# EasyEDA Pro project 智能车主板.eprj

# Schematic Schematic1
Create Date: 2023-10-10; Page Name: 原理图; Project Name: 智能车主板; Schematic Name: Schematic1; Update Date: 2023-10-11; Company: 王庆浩; Page Size: A3; Version: V1.0
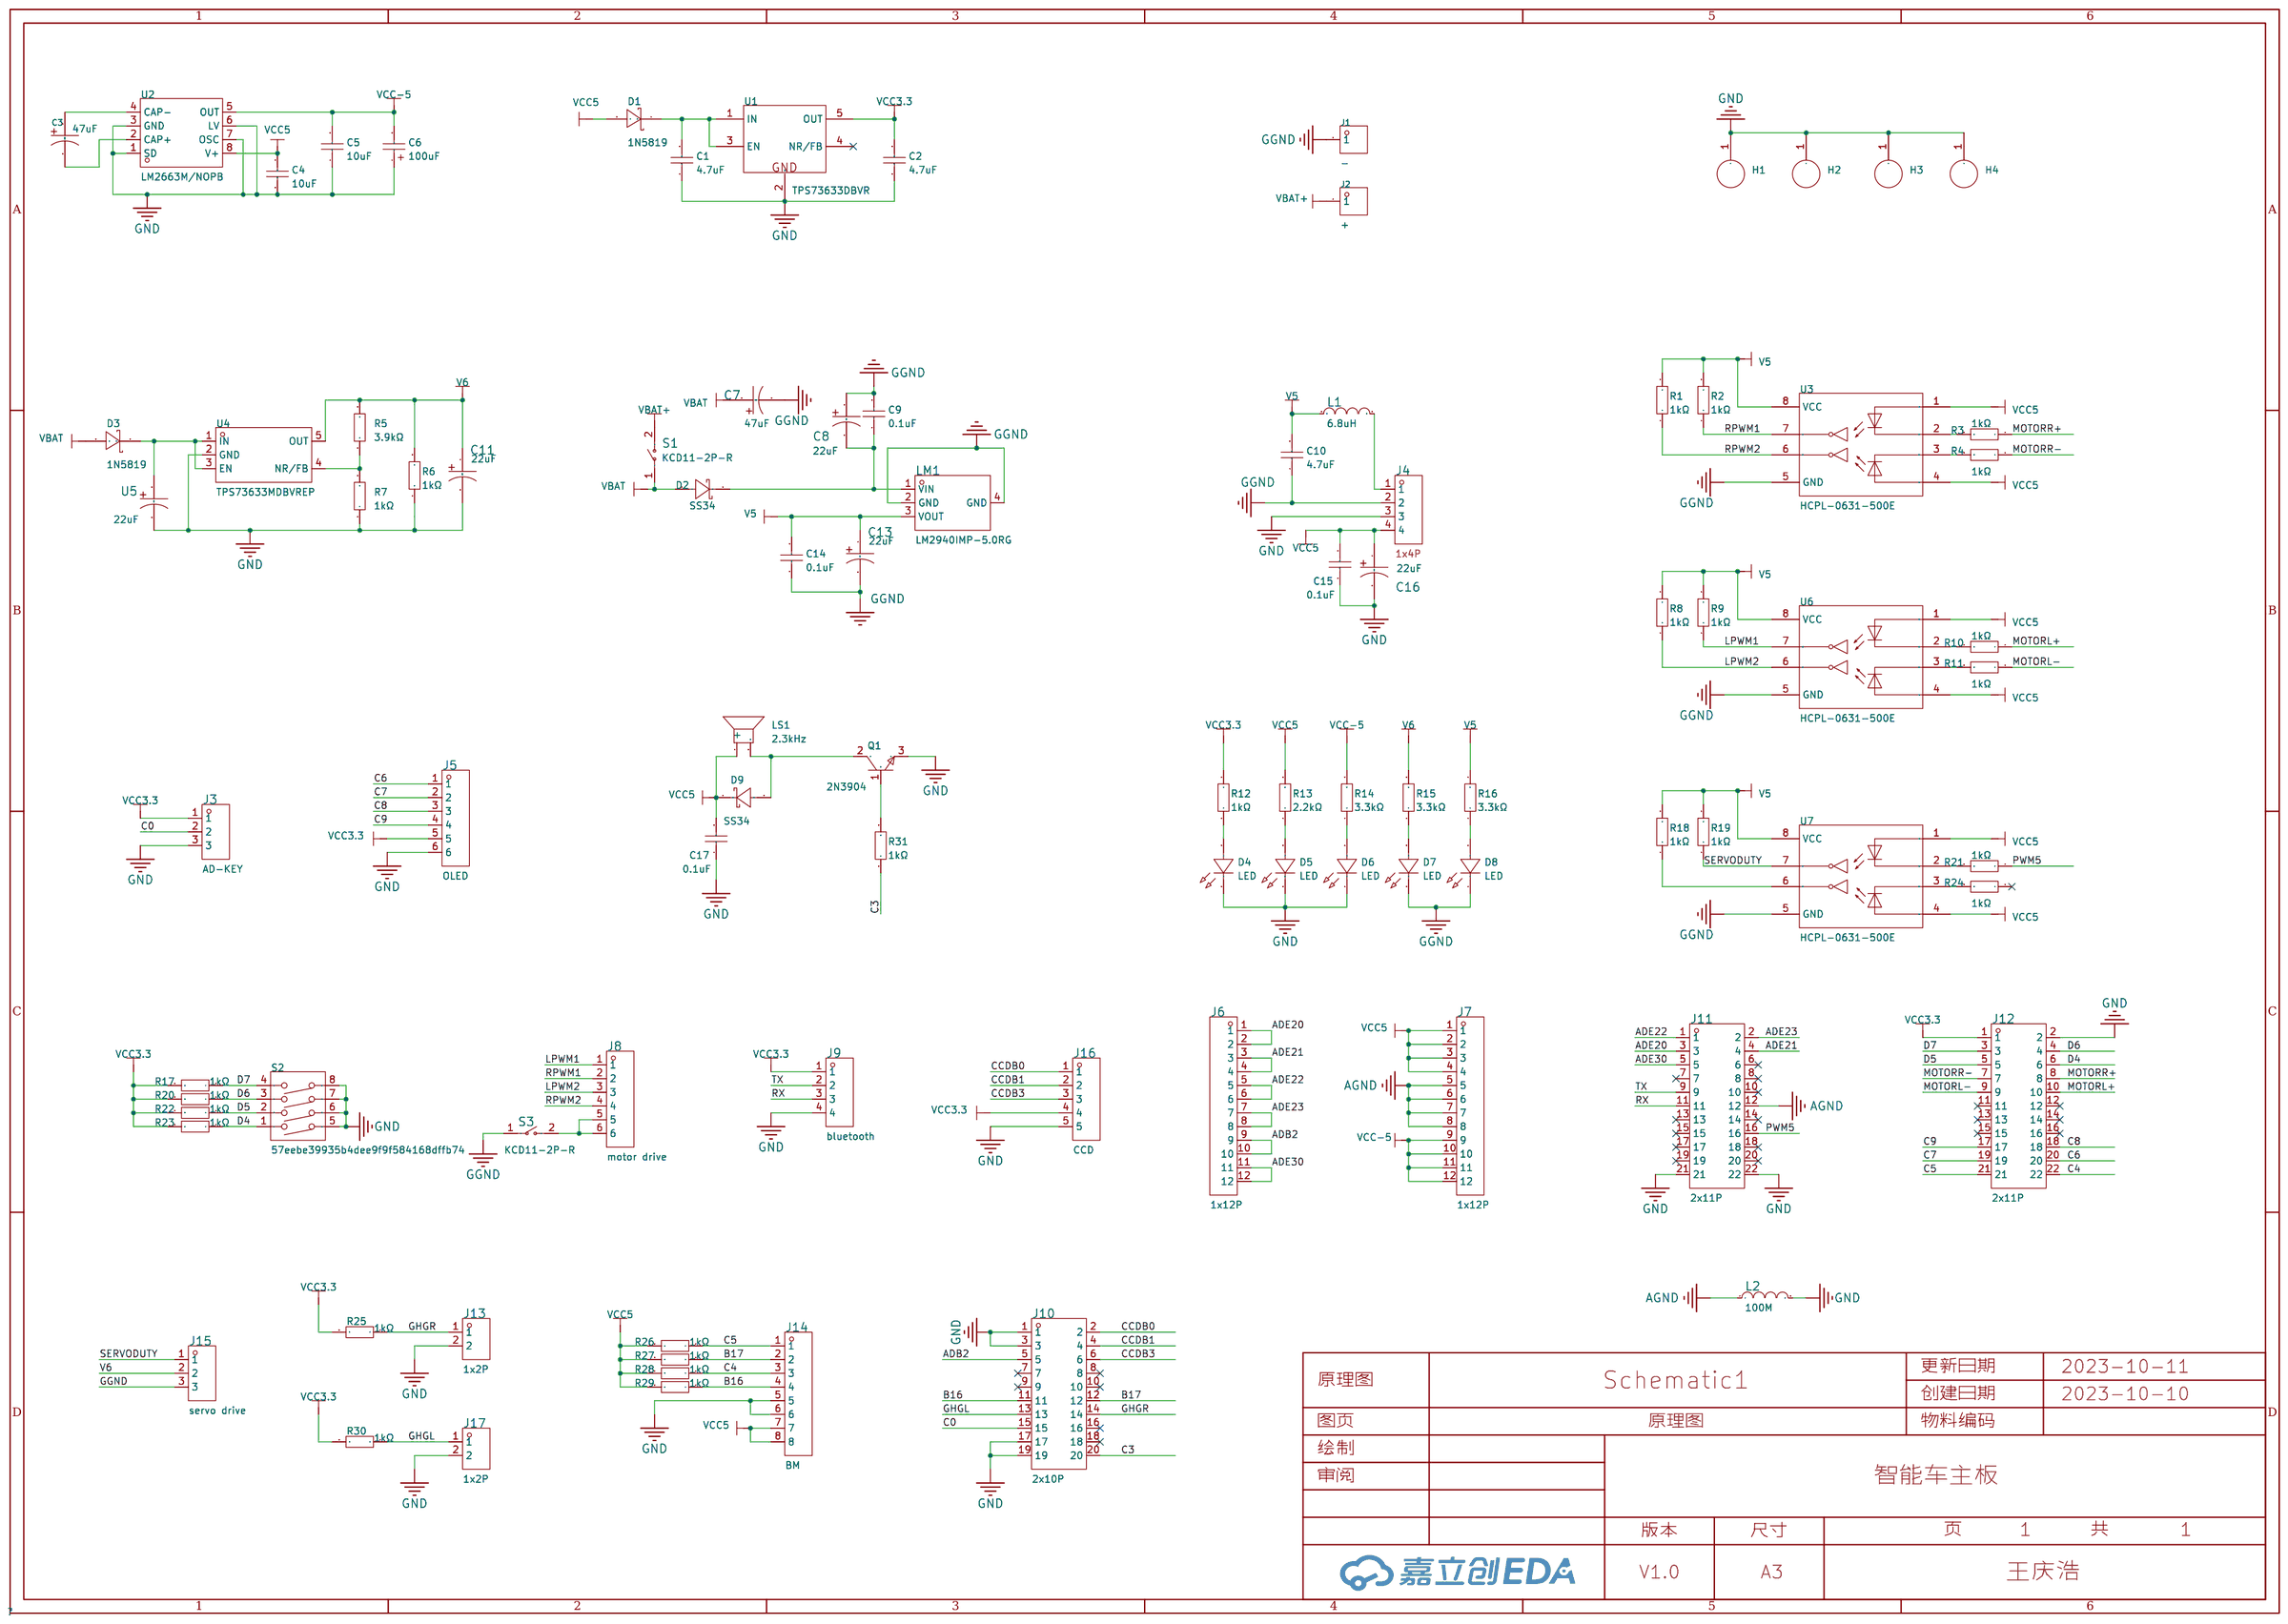
[diagram p0: schematic sheet]

## Parts
C1  4.7uF  [C0805]
C2  4.7uF  [C0805]
C3  47uF  [CAP-SMD_L6.0-W3.2-R-RD]
C4  10uF  [C0805]
C5  10uF  [C0805]
C6  100uF  [CAP-SMD_L3.2-W1.6-RD-C7171]
C7  47uF  [CAP-SMD_L7.3-W4.3-RD]
C8  22uF  [CAP-SMD_L6.0-W3.2-R-RD]
C9  0.1uF  [C0805]
C10  4.7uF  [C0805]
C11  22uF  [CAP-SMD_L7.3-W4.3-RD]
C13  22uF  [CAP-SMD_L7.3-W4.3-RD]
C14  0.1uF  [C0805]
C15  0.1uF  [C0805]
C16  22uF  [CAP-SMD_L7.3-W4.3-RD]
C17  0.1uF  [C0805]
D1  1N5819  [SMA_L4.4-W2.6-LS5.0-RD]
D2  SS34  [SMA_L4.3-W2.5-LS5.0-RD]
D3  1N5819  [SMA_L4.4-W2.6-LS5.0-RD]
D4  LED  [LED0805-RD_RED]
D5  LED  [LED0805-RD_RED]
D6  LED  [LED0805-RD_RED]
D7  LED  [LED0805-RD_RED]
D8  LED  [LED0805-RD_RED]
D9  SS34  [SMA_L4.3-W2.5-LS5.0-RD]
H1  -  [固定孔封装]
H2  -  [固定孔封装]
H3  -  [固定孔封装]
H4  -  [固定孔封装]
J1  -  [HDR-SMD_1P-P2.54-V-M_XKB_R1]
J2  +  [HDR-SMD_1P-P2.54-V-M_XKB_R1]
J3  AD-KEY  [HDR-TH_3P-P2.54-V-M]
J4  bf6de8a097bd4b3495073099155543ed  [HDR-TH_4P-P2.54-V-M]
J5  OLED  [HDR-TH_6P-P2.54-V-M]
J6  1x12P  [HDR-TH_12P-P2.54-V-M]
J7  1x12P  [HDR-TH_12P-P2.54-V-M]
J8  motor drive  [HDR-TH_6P-P2.54-V-M]
J9  bluetooth  [HDR-TH_4P-P2.54-V-M]
J10  2x10P  [HDR-TH_20P-P2.54-V-M-R2-C10-S2.54]
J11  2x11P  [HDR-TH_22P-P2.54-V-M-R2-C11-S2.54]
J12  2x11P  [HDR-TH_22P-P2.54-V-M-R2-C11-S2.54]
J13  1x2P  [HDR-TH_2P-P2.54-V-M]
J14  BM  [HDR-TH_8P-P2.54-V-M]
J15  servo drive  [HDR-TH_3P-P2.54-V-M]
J16  CCD  [HDR-TH_5P-P2.00-V-M]
J17  1x2P  [HDR-TH_2P-P2.54-V-M]
L1  6.8uH  [L0603]
L2  100M  [L0603]
LM1  LM2940IMP-5.0RG  [SOT-223-4_L6.5-W3.5-P2.30-LS7.0-BR]
LS1  2.3kHz  [BUZ-TH_BD12.0-P7.60-D0.6-FD]
Q1  2N3904  [TO-92-3_L4.6-W3.6-P1.30-L_2N3904]
R1  1kΩ  [R0805]
R2  1kΩ  [R0805]
R3  1kΩ  [R0805]
R4  1kΩ  [R0805]
R5  3.9kΩ  [R0805]
R6  1kΩ  [R0805]
R7  1kΩ  [R0805]
R8  1kΩ  [R0805]
R9  1kΩ  [R0805]
R10  1kΩ  [R0805]
R11  1kΩ  [R0805]
R12  1kΩ  [R0805]
R13  2.2kΩ  [R0805]
R14  3.3kΩ  [R0805]
R15  3.3kΩ  [R0805]
R16  3.3kΩ  [R0805]
R17  1kΩ  [R0805]
R18  1kΩ  [R0805]
R19  1kΩ  [R0805]
R20  1kΩ  [R0805]
R21  1kΩ  [R0805]
R22  1kΩ  [R0805]
R23  1kΩ  [R0805]
R24  1kΩ  [R0805]
R25  1kΩ  [R0805]
R26  1kΩ  [R0805]
R27  1kΩ  [R0805]
R28  1kΩ  [R0805]
R29  1kΩ  [R0805]
R30  1kΩ  [R0805]
R31  1kΩ  [R0805]
S1  KCD11-2P-R  [SW-TH_2P-L15.0-W10.5-P5.00_KCD11-2P-R]
S2  57eebe39935b4dee9f9f584168dffb74  [SW-TH_DSWB04LHGET]
S3  KCD11-2P-R  [SW-TH_2P-L15.0-W10.5-P5.00_KCD11-2P-R]
U1  TPS73633DBVR  [SOT-23-5_L3.0-W1.7-P0.95-LS2.8-BR]
U2  LM2663M/NOPB  [SOIC-8_L4.9-W3.9-P1.27-LS6.0-BL]
U3  HCPL-0631-500E  [SOIC-8_L4.9-W3.9-P1.27-LS6.0-BL]
U4  TPS73633MDBVREP  [SOT-23-5_L2.9-W1.6-P0.95-LS2.8-BR]
U5  22uF  [CAP-SMD_L7.3-W4.3-RD]
U6  HCPL-0631-500E  [SOIC-8_L4.9-W3.9-P1.27-LS6.0-BL]
U7  HCPL-0631-500E  [SOIC-8_L4.9-W3.9-P1.27-LS6.0-BL]

## Library data of the parts
C1 C2 C4 C5 = CL21A106KAYNNNE_C15850: 容值:10uF;精度:±10%;额定电压:25V;材质(温度系数):X5R;; LCSC Part Name: 10uF ±10% 25V; Supplier Part: C15850; Manufacturer: SAMSUNG(三星); Manufacturer Part: CL21A106KAYNNNE; Supplier Footprint: 0805; JLCPCB Part Class: 基础库; Datasheet: https://atta.szlcsc.com/upload/public/pdf/source/20160103/1457707679302.pdf; Supplier: LCSC; Tolerance: ±10%; Voltage Rated: 25V; Temperature Coefficient: X5R
C3 C8 = 293D476X0016C2TE3: 容值:47uF;精度:±20%;额定电压:16V;等效串联电阻:1Ω;; LCSC Part Name: 47uF ±20% 16V; Supplier Part: C3008964; Manufacturer: VISHAY(威世); Supplier Footprint: CASE-C-6032-28(mm); JLCPCB Part Class: Extended Part; Datasheet: https://atta.szlcsc.com/upload/public/pdf/source/20220525/65753A40397FD1DF7C7325870DC95DD0.pdf; Supplier: LCSC; Tolerance: ±20%; Rated Voltage: 16V; Equivalent Series Resistance(ESR): 1Ω; Operating Temperature: -55℃~+125℃
C6 = TAJA106K016RNJ: 容值:10uF;精度:±10%;额定电压:16V;等效串联电阻:3Ω@100kHz;; LCSC Part Name: 10uF ±10% 16V; Supplier Part: C7171; Manufacturer: Kyocera AVX; Supplier Footprint: CASE-A-3216; JLCPCB Part Class: 基础库; Datasheet: https://atta.szlcsc.com/upload/public/pdf/source/20160107/1457707748093.pdf; Supplier: LCSC; Tolerance: ±10%; Rated Voltage: 16V; Equivalent Series Resistance(ESR): 3Ω@100kHz; Operating Temperature: -55℃~+125℃
C7 C11 C13 C16 U5 = 293D475X9035D2TE3: LCSC Part Name: 钽电容; Supplier Part: C2980145; Manufacturer: VISHAY(威世); Supplier Footprint: CASE-D-7343-31(mm); JLCPCB Part Class: Extended Part; Datasheet: https://atta.szlcsc.com/upload/public/pdf/source/20230201/36862275542DDD9C7A81351881AA3AA9.pdf; Supplier: LCSC
C9 C10 C14 C15 C17 = CC0805KRX7R9BB104: 容值:100nF;精度:±10%;额定电压:50V;材质(温度系数):X7R;; LCSC Part Name: 100nF ±10% 50V; Supplier Part: C49678; Manufacturer: YAGEO(国巨); Supplier Footprint: 0805; JLCPCB Part Class: 基础库; Datasheet: https://atta.szlcsc.com/upload/public/pdf/source/20151026/1457707504898.pdf; Supplier: LCSC; Tolerance: ±10%; Voltage Rated: 50V; Temperature Coefficient: X7R
D1 D3 = 1N5819_C437199: 直流反向耐压(Vr):40V;平均整流电流(Io):1A;正向压降(Vf):500mV@1A;; LCSC Part Name: 40V 1A 500mV@1A; Supplier Part: C437199; Manufacturer: KEXIN(科信); Supplier Footprint: SMA; JLCPCB Part Class: Extended Part; Datasheet: https://atta.szlcsc.com/upload/public/pdf/source/20191012/C437199_83583E622A6684E767605E43C169C596.pdf; Supplier: LCSC; Reverse Voltage (Vr): 40V; Average Rectified Current (Io): 1A; Forward Voltage (Vf@If): 500mV@1A
D2 D9 = SS34_C727060: 二极管配置:独立式;直流反向耐压(Vr):40V;平均整流电流(Io):3A;正向压降(Vf):550mV@3A;; LCSC Part Name: 40V 3A 550mV@3A; Supplier Part: C727060; Manufacturer: TWGMC(台湾迪嘉); Supplier Footprint: SMA; JLCPCB Part Class: Extended Part; Datasheet: https://atta.szlcsc.com/upload/public/pdf/source/20200828/C727059_6599B6CAC5F3238B9C33E46794659DBE.pdf; Supplier: LCSC; Diode Configuration: 独立式; Reverse Voltage (Vr): 40V; Average Rectified Current (Io): 3A; Forward Voltage (Vf@If): 550mV@3A; Reverse Leakage Current (Ir): 500uA@40V
D4-D8 = XL-2012SURC: 发光颜色:红灯;主波长:617nm~621nm;色温:-;功率:55mW;安装方式:正贴;; LCSC Part Name: 红灯 正贴; Supplier Part: C965812; Manufacturer: XINGLIGHT(成兴光); Supplier Footprint: 0805; JLCPCB Part Class: Extended Part; Datasheet: https://atta.szlcsc.com/upload/public/pdf/source/20221102/49E1A0A365644091E6270AF1C5E0FE37.pdf; Supplier: LCSC; Emitted Color: 红灯; Lens Color: 无色透明; Dominant Wavelength: 617nm~621nm; Peak Wavelength: 623nm; Forward Current: 25mA; Power Dissipation: 55mW; Viewing Angle: 120°; Mounting Sytle: 正贴; Operating Temperature: -30℃~+85℃
H1-H4 = 固定孔: 铜柱孔
J1 J2 = X6511WVS-01H-C60D48R1: 排数:单排;总PIN位数:1P;间距:2.54mm;插针结构:1x1P;行距:-;安装类型:立贴;圆针/方针:方针;额定电流:3A;额定电压:250V;配合针长度:6mm;塑高:2.5mm;触头材质:黄铜;触头镀层:金;工作温度范围:-40℃~+105℃;焊接温度(最大值):260℃;颜色:黑色;; LCSC Part Name: 2.54mm 1x1P 立贴 方针; Supplier Part: C2883798; Manufacturer: XKB Connectivity(中国星坤); Supplier Footprint: SMD,P=2.54mm(交错脚); JLCPCB Part Class: Extended Part; Datasheet: https://atta.szlcsc.com/upload/public/pdf/source/20200909/C780060_F941EB1B69F43B5D6329EAF74E2E27BB.pdf; Supplier: LCSC; Number of Rows: 单排; Number of Pins: 1P; Pitch: 2.54mm; Pin Structure: 1x1P; Mounting Type: 立贴; Circluar Pins/Square Pins: 方针; Current Rating (Max): 3A; Voltage Rating (Max): 250V; Length of Mating Pin: 6mm; Insulation Height: 2.5mm; Contact Material: 黄铜; Contact Plating: 金; Operating Temperature Range: -40℃~+105℃; Welding Temperature (Max): 260℃; Color: 黑色; link: https://atta.szlcsc.com/upload/public/pdf/source/20200909/C780060_F941EB1B69F43B5D6329EAF74E2E27BB.pdf
J3 J15 = PZ254V-11-03P: 排数:单排;总PIN位数:3;间距:2.54mm;插针结构:1x3P;行距:-;安装类型:直插;圆针/方针:方针;额定电流:3A;额定电压:250V;配合针长度:6mm;塑高:2.5mm;端接针长度:3mm;工作温度范围:-40℃~+105℃;颜色:黑色;; LCSC Part Name: 2.54mm 1x3P 直插 方针; Supplier Part: C2937625; Manufacturer: XFCN(兴飞); Supplier Footprint: 直插,P=2.54mm; JLCPCB Part Class: 扩展库; Datasheet: 2022-07-12/581362A/62b9d00620994b3696be7eb4af85ad72/双排排针和单排排针.pdf; Supplier: LCSC; Number of Rows: 单排; Number of Pins: 3; Pitch: 2.54mm; Pin Structure: 1x3P; Mounting Type: 直插; Circluar Pins/Square Pins: 方针; Current Rating (Max): 3A; Voltage Rating (Max): 250V; Length of Mating Pin: 6mm; Insulation Height: 2.5mm; Length of End Connection Pin: 3mm; Operating Temperature Range: -40℃~+105℃; Color: 黑色
J4 J9 = PZ254V-11-04P: 排数:单排;总PIN位数:4P;间距:2.54mm;插针结构:1x4P;行距:-;安装类型:直插;圆针/方针:方针;额定电流:3A;额定电压:250V;配合针长度:6mm;塑高:2.5mm;端接针长度:3mm;触头材质:-;工作温度范围:-40℃~+105℃;颜色:黑色;; LCSC Part Name: 2.54mm 1x4P 直插 方针; Supplier Part: C2691448; Manufacturer: XFCN(兴飞); Supplier Footprint: 插件,P=2.54mm; JLCPCB Part Class: Extended Part; Datasheet: https://atta.szlcsc.com/upload/public/pdf/source/20200309/C492403_F9F19131791D08044AD4F84F8E751A34.pdf; Supplier: LCSC; Number of Rows: 单排; Number of Pins: 4P; Pitch: 2.54mm; Pin Structure: 1x4P; Mounting Type: 直插; Circluar Pins/Square Pins: 方针; Current Rating (Max): 3A; Voltage Rating (Max): 250V; Length of Mating Pin: 6mm; Insulation Height: 2.5mm; Length of End Connection Pin: 3mm; Operating Temperature Range: -40℃~+105℃; Color: 黑色
J5 J8 = PZ254V-11-06P: 排数:单排;总PIN位数:6;间距:2.54mm;插针结构:1x6P;行距:-;安装类型:直插;圆针/方针:方针;额定电流:-;额定电压:-;配合针长度:6mm;塑高:2.5mm;端接针长度:3mm;触头材质:黄铜;触头镀层:-;工作温度范围:-40℃~+105℃;颜色:黑色;; LCSC Part Name: 2.54mm 1x6P 直插 方针; Supplier Part: C492405; Manufacturer: XFCN(兴飞); Supplier Footprint: 直插,P=2.54mm; JLCPCB Part Class: Extended Part; Supplier: LCSC; Number of Rows: 单排; Number of Pins: 6; Pitch: 2.54mm; Pin Structure: 1x6P; Mounting Type: 直插; Circluar Pins/Square Pins: 方针; Length of Mating Pin: 6mm; Insulation Height: 2.5mm; Length of End Connection Pin: 3mm; Contact Material: 黄铜; Operating Temperature Range: -40℃~+105℃; Color: 黑色
J6 J7 = PZ254V-11-12P: 排数:单排;总PIN位数:12P;间距:2.54mm;插针结构:1x12P;行距:-;安装类型:直插;圆针/方针:方针;额定电流:3A;额定电压:250V;配合针长度:6mm;塑高:2.5mm;端接针长度:3mm;触头材质:-;工作温度范围:-40℃~+105℃;颜色:黑色;; LCSC Part Name: 2.54mm 1x12P 直插 方针; Supplier Part: C2840012; Manufacturer: XFCN(兴飞); Supplier Footprint: 插件,P=2.54mm; JLCPCB Part Class: Extended Part; Datasheet: https://atta.szlcsc.com/upload/public/pdf/source/20200309/C492403_F9F19131791D08044AD4F84F8E751A34.pdf; Supplier: LCSC; Number of Rows: 单排; Number of Pins: 12P; Pitch: 2.54mm; Mounting Type: 直插; Circluar Pins/Square Pins: 方针; Current Rating (Max): 3A; Voltage Rating (Max): 250V; Length of Mating Pin: 6mm; Insulation Height: 2.5mm; Length of End Connection Pin: 3mm; Operating Temperature Range: -40℃~+105℃; Color: 黑色
J10 = PZ254V-12-20P: 排数:双排;总PIN位数:20;间距:2.54mm;插针结构:2x10P;行距:2.54mm;安装类型:直插;圆针/方针:方针;额定电流:-;额定电压:-;配合针长度:6mm;塑高:2.5mm;端接针长度:3mm;触头材质:黄铜;触头镀层:-;工作温度范围:-40℃~+105℃;颜色:黑色;; LCSC Part Name: 2.54mm 2x10P 直插 方针; Supplier Part: C492427; Manufacturer: XFCN(兴飞); Supplier Footprint: 直插,P=2.54mm; JLCPCB Part Class: Extended Part; Supplier: LCSC; Number of Rows: 双排; Number of Pins: 20; Pitch: 2.54mm; Row Spacing: 2.54mm; Mounting Type: 直插; Circluar Pins/Square Pins: 方针; Length of Mating Pin: 6mm; Insulation Height: 2.5mm; Length of End Connection Pin: 3mm; Contact Material: 黄铜; Operating Temperature Range: -40℃~+105℃; Color: 黑色
J11 J12 = PZ254-2-11-Z-8.5: 排数:双排;总PIN位数:22;间距:2.54mm;插针结构:2x11P;行距:2.54mm;安装类型:直插;圆针/方针:方针;额定电流:3A;额定电压:-;配合针长度:6mm;塑高:2.5mm;端接针长度:3mm;触头材质:-;工作温度范围:-40℃~+105℃;颜色:黑色;; LCSC Part Name: 2.54mm 2x11P 直插 方针; Supplier Part: C2894972; Manufacturer: HCTL(华灿天禄); Supplier Footprint: 直插,P=2.54mm; JLCPCB Part Class: Extended Part; Datasheet: 2022-08-15/203417A/e0d2f1541a354e4c8402216b57662889/排针规格书.pdf; Supplier: LCSC; Number of Rows: 双排; Number of Pins: 22; Pitch: 2.54mm; Row Spacing: 2.54mm; Mounting Type: 直插; Circluar Pins/Square Pins: 方针; Current Rating (Max): 3A; Length of Mating Pin: 6mm; Insulation Height: 2.5mm; Length of End Connection Pin: 3mm; Operating Temperature Range: -40℃~+105℃; Color: 黑色
J13 J17 = PZ254V-11-02P: 排数:单排;总PIN位数:2P;间距:2.54mm;插针结构:1x2P;行距:-;安装类型:直插;圆针/方针:方针;额定电流:-;额定电压:-;配合针长度:6mm;塑高:2.5mm;端接针长度:3mm;触头材质:黄铜;触头镀层:-;工作温度范围:-40℃~+105℃;颜色:黑色;; LCSC Part Name: 2.54mm 1x2P 直插 方针; Supplier Part: C492401; Manufacturer: XFCN(兴飞); Supplier Footprint: 插件,P=2.54mm; JLCPCB Part Class: Extended Part; Datasheet: https://atta.szlcsc.com/upload/public/pdf/source/20200309/C492401_A812433581A9B211A7FFA413ADDFF0E5.pdf; Supplier: LCSC; Number of Rows: 单排; Number of Pins: 2P; Pitch: 2.54mm; Mounting Type: 直插; Circluar Pins/Square Pins: 方针; Length of Mating Pin: 6mm; Insulation Height: 2.5mm; Length of End Connection Pin: 3mm; Contact Material: 黄铜; Operating Temperature Range: -40℃~+105℃; Color: 黑色
J14 = PZ254V-11-08P: 排数:单排;总PIN位数:8P;间距:2.54mm;插针结构:1x8P;行距:-;安装类型:直插;圆针/方针:方针;额定电流:-;额定电压:-;配合针长度:6mm;塑高:2.5mm;端接针长度:3mm;触头材质:黄铜;触头镀层:-;工作温度范围:-40℃~+105℃;颜色:黑色;; LCSC Part Name: 2.54mm 1x8P 直插 方针; Supplier Part: C492407; Manufacturer: XFCN(兴飞); Supplier Footprint: 插件,P=2.54mm; JLCPCB Part Class: Extended Part; Datasheet: https://atta.szlcsc.com/upload/public/pdf/source/20200309/C492407_83A6FB26A2233368EDB9516968EC6149.pdf; Supplier: LCSC; Number of Rows: 单排; Number of Pins: 8P; Pitch: 2.54mm; Pin Structure: 1x8P; Mounting Type: 直插; Circluar Pins/Square Pins: 方针; Length of Mating Pin: 6mm; Insulation Height: 2.5mm; Length of End Connection Pin: 3mm; Contact Material: 黄铜; Operating Temperature Range: -40℃~+105℃; Color: 黑色
J16 = PZ200V-11-05P: 排数:单排;总PIN位数:5;间距:2mm;插针结构:1x5P;行距:-;安装类型:直插;圆针/方针:方针;额定电流:-;额定电压:-;配合针长度:3.9mm;塑高:2mm;端接针长度:2.8mm;触头材质:黄铜;触头镀层:-;工作温度范围:-40℃~+105℃;焊接温度(最大值):-;颜色:黑色;; LCSC Part Name: 2mm 1x5P 直插 方针; Supplier Part: C541859; Manufacturer: XFCN(兴飞); Supplier Footprint: 直插,P=2mm; JLCPCB Part Class: Extended Part; Supplier: LCSC; Number of Rows: 单排; Number of Pins: 5; Pitch: 2mm; Pin Structure: 1x5P; Mounting Type: 直插; Circluar Pins/Square Pins: 方针; Length of Mating Pin: 3.9mm; Insulation Height: 2mm; Length of End Connection Pin: 2.8mm; Contact Material: 黄铜; Operating Temperature Range: -40℃~+105℃; Color: 黑色
L1 L2 = SDFL1608S100KTF: 电感值:10uH;精度:±10%;额定电流:3mA;饱和电流(Isat):-;直流电阻(DCR):1.85Ω;; LCSC Part Name: 10uH ±10% 3mA 1.85Ω; Supplier Part: C1035; Manufacturer: Sunlord(顺络); Supplier Footprint: 0603; JLCPCB Part Class: 基础库; Supplier: LCSC; Tolerance: ±10%; Rated Current: 3mA; DC Resistance (DCR): 1.85Ω; Q @ Freq: 30@2MHz; Frequency - Self Resonant: 2MHz
LM1 = LM2940IMP-5.0RG: Supplier Part: C5145300; Manufacturer: HGC(深圳汉芯); Supplier Footprint: SOT-223; Datasheet: https://atta.szlcsc.com/upload/public/pdf/source/20230410/C7BD4CEE63E292837B75FC9C2A710A86.pdf; Supplier: LCSC
LS1 = TMB12A05_C96093: 驱动方式:有源(内含驱动线路);构造类型:电磁式;额定电压:5V;频率:2.3kHz;声压(SPL):85dB@5V,10cm;; LCSC Part Name: TMB12A05; Supplier Part: C96093; Manufacturer: 华能; Manufacturer Part: TMB12A05; Supplier Footprint: 插件,D=12mm; JLCPCB Part Class: Extended Part; Datasheet: https://atta.szlcsc.com/upload/public/pdf/source/20170522/1495448324811.pdf; Supplier: LCSC; Oscillator Circuit: 有源(内含驱动线路); Technology Type: 电磁式; Rated Voltage: 5V; Operating Voltage: 4V~8V; Sound Pressure Level (SPL): 85dB@5V,10cm; Diameter (φD): 12mm; Height: 9.8mm
Q1 = 2N3904_C2874602: Supplier Part: C2874602; Manufacturer: JSMSEMI(杰盛微); Supplier Footprint: TO-92; JLCPCB Part Class: Extended Part; Datasheet: https://atta.szlcsc.com/upload/public/pdf/source/20211216/4B1D0208BBB09785024BED84C152EFE5.pdf; Supplier: LCSC
R1-R31 = 0805W8F3901T5E: 电阻类型:厚膜电阻;阻值:3.9kΩ;精度:±1%;功率:125mW;; LCSC Part Name: 3.9kΩ ±1% 125mW; Supplier Part: C17614; Manufacturer: UNI-ROYAL(厚声); Supplier Footprint: 0805; JLCPCB Part Class: Basic Part; Datasheet: https://atta.szlcsc.com/upload/public/pdf/source/20200306/C422600_1E6D84923E4A46A82E41ADD87F860B5C.pdf; Supplier: LCSC; Type: 厚膜电阻; Tolerance: ±1%; Power(Watts): 125mW; Temperature Coefficient: ±100ppm/℃; Overload Voltage (Max): 150V; Operating Temperature Range: -55℃~+155℃
S1 S3 = KCD11-2P-R: 额定电流:3A;额定电压(AC):250V;额定电压(DC):-;电路结构:单刀单掷;机械寿命:1万次;带灯:无;引脚样式:焊片;; LCSC Part Name: 10.5*15mm 两脚两档跷板开关 红钮; Supplier Part: C5884414; Manufacturer: SHOU HAN(首韩); Supplier Footprint: 插件; JLCPCB Part Class: Extended Part; Datasheet: https://atta.szlcsc.com/upload/public/pdf/source/20230506/CD06DFDE35C8048D34175BFF4AF6A2C2.pdf; Supplier: LCSC; Contact Current: 3A; Voltage Rating (AC): 250V; Circuit: 单刀单掷; Mechanical Life: 1万次; Actuator Type: 凹面弯曲; Actuator Color: 红色; Actuator Identifier: - O; With Lamp: 无; Pin Style: 焊片; Operating Temperature: 0℃~+125℃; Switch Length: 15mm; Switch Width: 10.5mm; Switch Height: 17.2mm
S2 = DSWB04LHGET: 类型:平拨,凸起式;电路结构:单刀单掷;开关位数:4;使用寿命:-;颜色:红色;; LCSC Part Name: 间距2.54mm 平拨,凸起式 4位拨码开关; Supplier Part: C99418; Manufacturer: YE; Supplier Footprint: 插件; JLCPCB Part Class: Extended Part; Datasheet: https://atta.szlcsc.com/upload/public/pdf/source/20220830/02827E67A8727938D957A3CE4C86C92D.pdf; Supplier: LCSC; Type: 平拨,凸起式; Circuit: 单刀单掷; Number of Positions: 4; Lead Pitch: 2.54mm; Color: 红色
U1 = TPS73633DBVR: 输出类型:固定;输出极性:正;最大输入电压:5.5V;输出电压:3.3V;输出电流:400mA;电源纹波抑制比(PSRR):58dB;; LCSC Part Name: 输入5.5V 输出3.3V 400mA; Supplier Part: C28038; Manufacturer: TI(德州仪器); Supplier Footprint: SOT-23-5; JLCPCB Part Class: Extended Part; Datasheet: https://atta.szlcsc.com/upload/public/pdf/source/20140314/1457707018586.pdf; Supplier: LCSC; Output Type: 固定; Output Polarity: 正; Number of Outputs: 1; Maximum Input Voltage: 5.5V; Output Voltage: 3.3V; Dropout Voltage: 200mV@(400mA); Output Current: 400mA; Power Supply Rejection Ratio (PSRR): 58dB
U2 = LM2663M/NOPB: LM2663 具有低电流关断模式的 200mA 开关电容器电压转换器; Supplier Part: C544380; Manufacturer: TI(德州仪器); Supplier Footprint: SOIC; JLCPCB Part Class: 扩展库; Datasheet: 2021-11-24/659541A/1d66f5dbf11b46749b6d06db606fb117/LM2663.pdf; Supplier: LCSC
U3 U6 U7 = HCPL-0631-500E: 通道数:2;隔离电压:3.75kV;输入类型:DC;共模瞬变抗扰度CMTI:10kV/us;数据速率:10Mbit/s;传播延迟tpLH/tpHL:75ns,75ns;电源电压:4.5V~5.5V;工作温度:-40℃~+85℃;; Supplier Part: C43949; Manufacturer: AVAGO(安华高); Supplier Footprint: SOIC-8; JLCPCB Part Class: 扩展库; Datasheet: https://atta.szlcsc.com/upload/public/pdf/source/20150319/1457707270229.pdf; Supplier: LCSC; Number of Channels: 2; Isolation Voltage: 3.75kV; Input Type: DC; Common Mode Transient Immunity (CMTI): 10kV/us; Data Rate: 10Mbit/s; Propagation Delay tpLH/tpHL: 75ns,75ns; Supply Voltage: 4.5V~5.5V; Operating Temperature: -40℃~+85℃
U4 = TPS73633MDBVREP: Supplier Part: C2877638; Manufacturer: TI(德州仪器); Supplier Footprint: SOT-23-5; JLCPCB Part Class: Extended Part; Supplier: LCSC

## Nets
AGND: J7.5 J7.6 J7.7 J7.8 J11.12 L2.1
GND: C1.1 C2.1 C4.1 C5.1 C6.1 C11.2 C15.1 C16.2 C17.1 D4.1(K) D5.1(K) D6.1(K) H1.1 H2.1 H3.1 H4.1 J3.3 J4.3 J5.6 J9.4 J10.1 J10.3 J10.17 J10.19 J11.21 J11.22 J12.2 J13.2 J14.5 J14.6 J16.5 J17.2 L2.2 Q1.3(E) R6.1 R7.1 S2.5 S2.6 S2.7 S2.8 U1.2(GND) U2.1(SD) U2.3(GND) U2.6(LV) U2.7(OSC) U4.2(GND) U5.2
V5: C10.2 C13.1 C14.2 L1.1 LM1.3(VOUT) R1.2 R2.2 R8.2 R9.2 R16.2 R18.2 R19.2 U3.8(VCC) U6.8(VCC) U7.8(VCC)
V6: C11.1 J15.2 R5.2 R6.2 R15.2 U4.5(OUT)
VBAT: C7.1 D2.2(A) D3.2(A) S1.1
VBAT+: J2.1 S1.2
VCC3.3: C2.2 J3.1 J5.5 J9.1 J12.1 J16.4 R12.2 R17.2 R20.2 R22.2 R23.2 R25.2 R30.2 U1.5(OUT)
VCC5: C4.2 C15.2 C16.1 C17.2 D1.2(A) D9.1(C) J4.4 J7.1 J7.2 J7.3 J7.4 J14.7 J14.8 LS1.1(+) R13.2 R26.2 R27.2 R28.2 R29.2 U2.8(V+) U3.1(AN1) U3.4(AN2) U6.1(AN1) U6.4(AN2) U7.1(AN1) U7.4(AN2)
VCC-5: C5.2 C6.2 J7.9 J7.10 J7.11 J7.12 R14.2 U2.5(OUT)
ADB2: J6.9 J6.10 J10.5
ADE20: J6.1 J6.2 J11.3
ADE21: J6.3 J6.4 J11.4
ADE22: J6.5 J6.6 J11.1
ADE23: J6.7 J6.8 J11.2
ADE30: J6.11 J6.12 J11.5
B16: J10.11 J14.4 R29.1
B17: J10.12 J14.2 R27.1
C0: J3.2 J10.15
C3: J10.20 R31.1
C4: J12.22 J14.3 R28.1
C5: J12.21 J14.1 R26.1
C6: J5.1 J12.20
C7: J5.2 J12.19
C8: J5.3 J12.18
C9: J5.4 J12.17
CCDB0: J10.2 J16.1
CCDB1: J10.4 J16.2
CCDB3: J10.6 J16.3
D4: J12.6 R23.1 S2.1
D5: J12.5 R22.1 S2.2
D6: J12.4 R20.1 S2.3
D7: J12.3 R17.1 S2.4
GGND: C7.2 C8.1 C9.2 C10.1 C13.2 C14.1 D7.1(K) D8.1(K) J1.1 J4.2 J15.3 LM1.2(GND) LM1.4(GND) S3.1 U3.5(GND) U6.5(GND) U7.5(GND)
GHGL: J10.13 J17.1 R30.1
GHGR: J10.14 J13.1 R25.1
LPWM1: J8.1 R9.1 U6.7(VO1)
LPWM2: J8.3 R8.1 U6.6(VO2)
MOTORL+: J12.10 R10.1
MOTORL-: J12.9 R11.1
MOTORR+: J12.8 R3.1
MOTORR-: J12.7 R4.1
PWM5: J11.16 R21.1
RPWM1: J8.2 R2.1 U3.7(VO1)
RPWM2: J8.4 R1.1 U3.6(VO2)
RX: J9.3 J11.11
SERVODUTY: J15.1 R19.1 U7.7(VO1)
TX: J9.2 J11.9
$1N186: C3.1 U2.4(CAP-)
$1N262: C3.2 U2.2(CAP+)
$1N1005: C1.2 D1.1(C) U1.1(IN) U1.3(EN)
$1N3929: D3.1(C) U4.1(IN) U4.3(EN) U5.1
$1N4120: R5.1 R7.2 U4.4(NR/FB)
$1N5968: C8.2 C9.1 D2.1(C) LM1.1(VIN)
$1N6419: J4.1 L1.2
$1N6913: R3.2 U3.2(CAT1)
$1N6963: R4.2 U3.3(CAT2)
$1N7242: R10.2 U6.2(CAT1)
$1N7247: R11.2 U6.3(CAT2)
$1N7507: R18.1 U7.6(VO2)
$1N7520: R21.2 U7.2(CAT1)
$1N7525: R24.2 U7.3(CAT2)
$1N11111: D9.2(A) LS1.2 Q1.2(C)
$1N11153: Q1.1(B) R31.2
$1N11725: D4.2(A) R12.1
$1N11731: D5.2(A) R13.1
$1N11737: D6.2(A) R14.1
$1N11743: D7.2(A) R15.1
$1N11746: D8.2(A) R16.1
$1N12522: J8.5 J8.6 S3.2

Not connected (* = marked no-connect by the designer): J10 7* 8* 9* 10* 16* 18*; J11 6* 7* 8* 10* 13* 14* 15* 17* 18* 19* 20*; J12 11* 12* 13* 14* 15* 16*; R24 1*; U1 4(NR/FB)*

# Board PCB
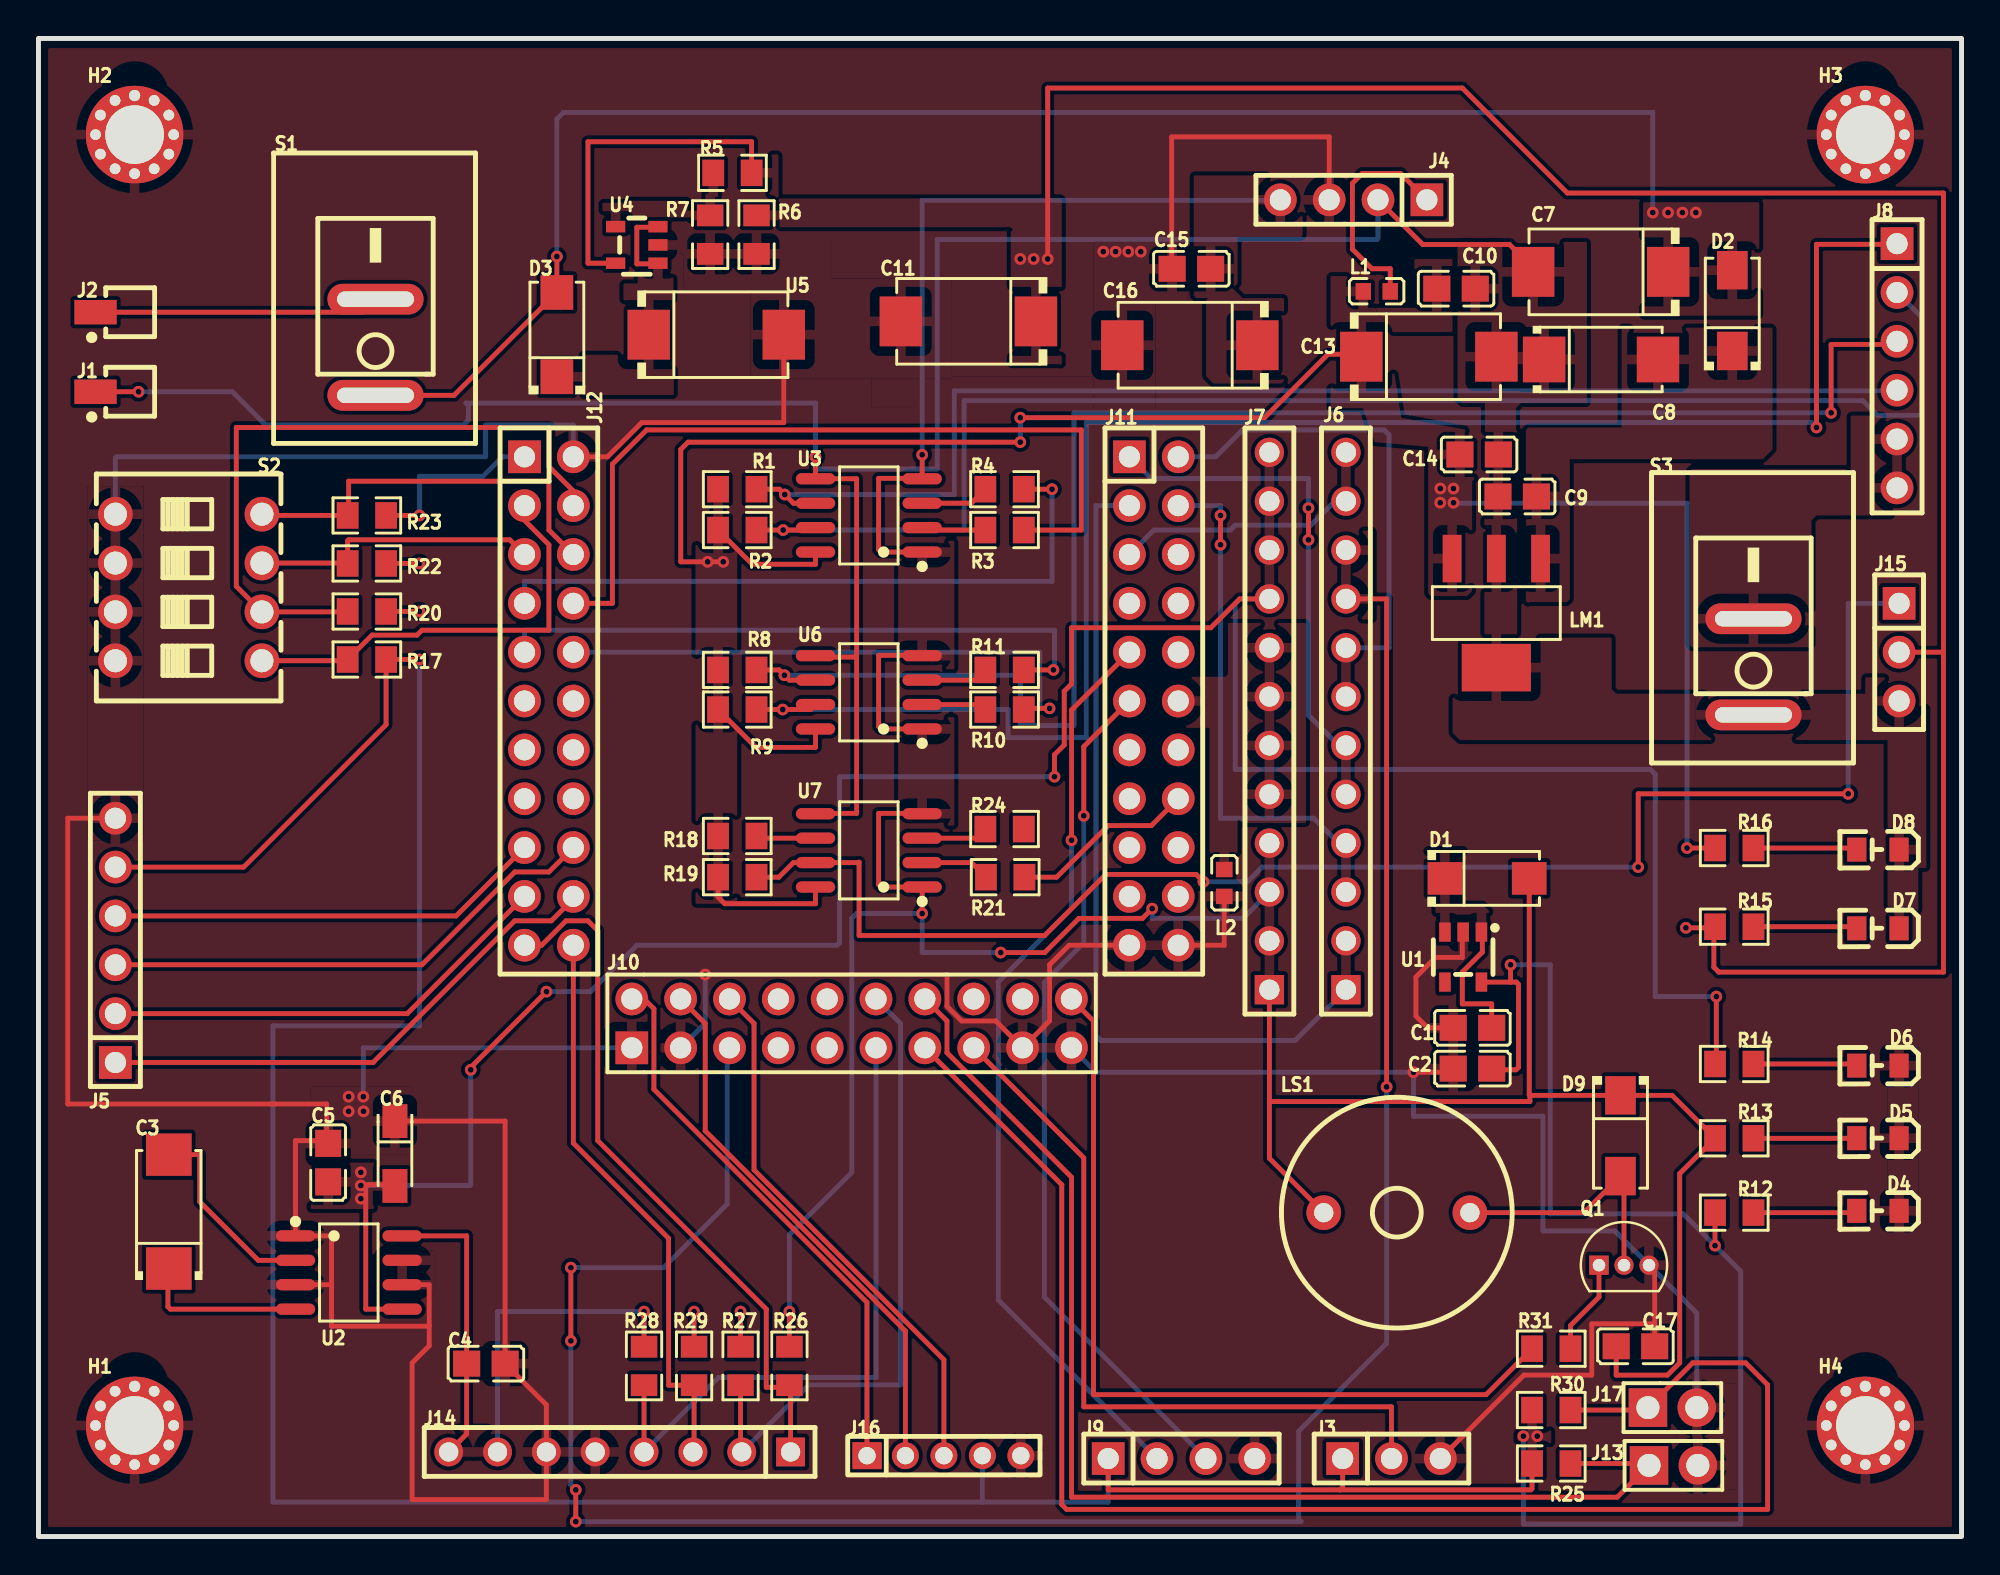
[diagram p1: board, top side]
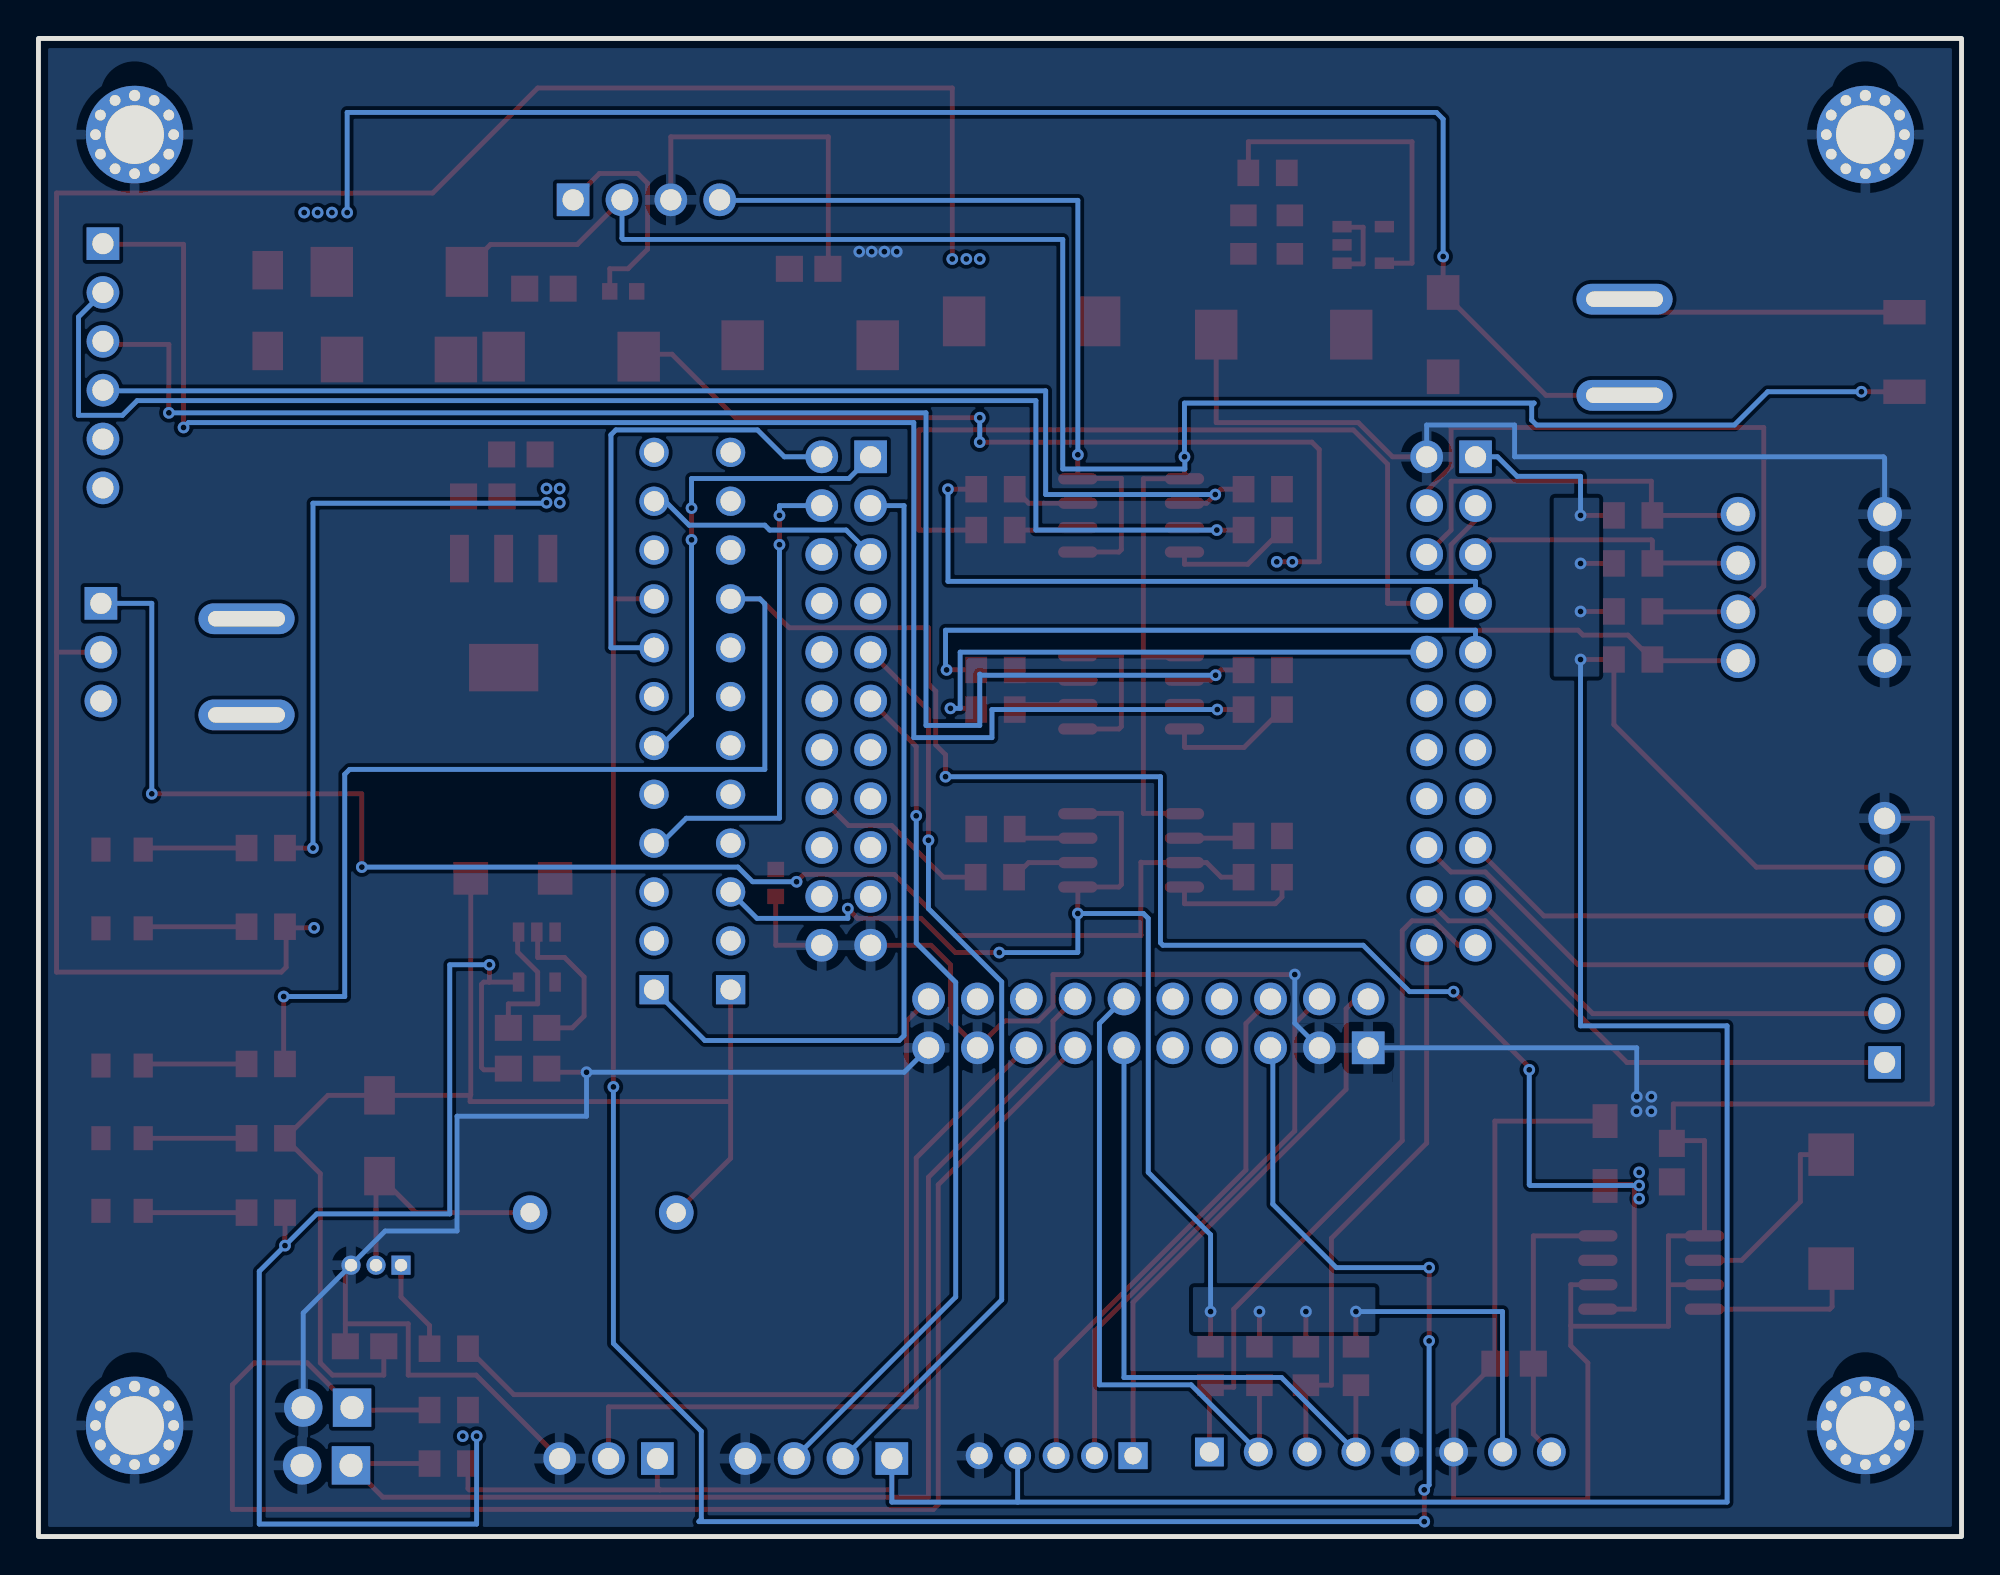
[diagram p2: board, bottom side, seen from below]

Outline 100 x 77.9 mm; copper layers: Top Layer, Bottom Layer. Coordinates in mm from the lower left corner of the outline.
Outline path: rectangle 0,77.9 100,0
Stack: Top Layer 0.035mm / Dielectric1 1.51mm FR4 er 4.5 / Bottom Layer 0.035mm

## Design rules (mm)
template: JLCPCB Capability(Two Layers Board)
spacing copperThickness1oz (default): track to track 0.102, other pairs 0.152 to 0.3
spacing copperThickness2oz: track to track 0.203, other pairs 0.152 to 0.3
track width copperThickness1oz (default): min 0.127, default 0.254, max 2.54
track width copperThickness2oz: min 0.203, default 0.254, max 2.54
differential pair differentialPair (default): width min 0.127, default 0.254, max 2.54; gap min 0.152, default 0.152
via viaSize (default): diameter min 0.5, default 0.61, max 10; hole min 0.3, default 0.305, max 6.3

## Placement (name value [footprint] x y rotation side)
C1  4.7uF  [C0805]  74.57 26.45 0 top
C2  4.7uF  [C0805]  74.57 24.33 0 top
C3  47uF  [CAP-SMD_L6.0-W3.2-R-RD]  6.78 16.9 270 top
C4  10uF  [C0805]  23.27 8.99 180 top
C5  10uF  [C0805]  15.06 19.45 270 top
C6  100uF  [CAP-SMD_L3.2-W1.6-RD-C7171]  18.54 19.92 270 top
C7  47uF  [CAP-SMD_L7.3-W4.3-RD]  81.23 65.77 0 top
C8  22uF  [CAP-SMD_L6.0-W3.2-R-RD]  81.25 61.21 180 top
C9  0.1uF  [C0805]  76.9 54.08 180 top
C10  4.7uF  [C0805]  73.72 64.89 180 top
C11  22uF  [CAP-SMD_L7.3-W4.3-RD]  48.36 63.19 0 top
C13  22uF  [CAP-SMD_L7.3-W4.3-RD]  72.3 61.36 180 top
C14  0.1uF  [C0805]  74.91 56.27 180 top
C15  0.1uF  [C0805]  59.95 65.92 0 top
C16  22uF  [CAP-SMD_L7.3-W4.3-RD]  59.87 61.95 0 top
C17  0.1uF  [C0805]  83.04 9.89 180 top
D1  1N5819  [SMA_L4.4-W2.6-LS5.0-RD]  75.33 34.23 0 top
D2  SS34  [SMA_L4.3-W2.5-LS5.0-RD]  88.08 63.75 90 top
D3  1N5819  [SMA_L4.4-W2.6-LS5.0-RD]  26.96 62.5 90 top
D4  LED  [LED0805-RD_RED]  95.65 16.94 180 top
D5  LED  [LED0805-RD_RED]  95.65 20.71 180 top
D6  LED  [LED0805-RD_RED]  95.65 24.49 180 top
D7  LED  [LED0805-RD_RED]  95.65 31.63 180 top
D8  LED  [LED0805-RD_RED]  95.65 35.72 180 top
D9  SS34  [SMA_L4.3-W2.5-LS5.0-RD]  82.26 20.84 270 top
H1  -  [固定孔封装]  5 5.78 0 top
H2  -  [固定孔封装]  5 72.9 0 top
H3  -  [固定孔封装]  95 72.9 0 top
H4  -  [固定孔封装]  95 5.78 0 top
J1  -  [HDR-SMD_1P-P2.54-V-M_XKB_R1]  2.97 59.53 90 top
J2  +  [HDR-SMD_1P-P2.54-V-M_XKB_R1]  2.97 63.67 90 top
J3  AD-KEY  [HDR-TH_3P-P2.54-V-M]  70.36 4.06 0 top
J4  bf6de8a097bd4b3495073099155543ed  [HDR-TH_4P-P2.54-V-M]  68.39 69.51 180 top
J5  OLED  [HDR-TH_6P-P2.54-V-M]  4 31 90 top
J6  1x12P  [HDR-TH_12P-P2.54-V-M]  67.99 42.41 90 top
J7  1x12P  [HDR-TH_12P-P2.54-V-M]  64.01 42.41 90 top
J8  motor drive  [HDR-TH_6P-P2.54-V-M]  96.65 60.88 270 top
J9  bluetooth  [HDR-TH_4P-P2.54-V-M]  59.44 4.06 0 top
J10  2x10P  [HDR-TH_20P-P2.54-V-M-R2-C10-S2.54]  42.28 26.68 0 top
J11  2x11P  [HDR-TH_22P-P2.54-V-M-R2-C11-S2.54]  58 43.45 270 top
J12  2x11P  [HDR-TH_22P-P2.54-V-M-R2-C11-S2.54]  26.54 43.45 270 top
J13  1x2P  [HDR-TH_2P-P2.54-V-M]  85.02 3.7 0 top
J14  BM  [HDR-TH_8P-P2.54-V-M]  30.22 4.4 180 top
J15  servo drive  [HDR-TH_3P-P2.54-V-M]  96.75 45.99 270 top
J16  CCD  [HDR-TH_5P-P2.00-V-M]  47.08 4.21 0 top
J17  1x2P  [HDR-TH_2P-P2.54-V-M]  84.96 6.7 0 top
L1  6.8uH  [L0603]  69.59 64.75 0 top
L2  100M  [L0603]  61.66 33.99 270 top
LM1  LM2940IMP-5.0RG  [SOT-223-4_L6.5-W3.5-P2.30-LS7.0-BR]  75.81 48.02 90 top
LS1  2.3kHz  [BUZ-TH_BD12.0-P7.60-D0.6-FD]  70.63 16.84 0 top
Q1  2N3904  [TO-92-3_L4.6-W3.6-P1.30-L_2N3904]  82.45 14.11 0 top
R1  1kΩ  [R0805]  36.34 54.46 180 top
R2  1kΩ  [R0805]  36.34 52.34 180 top
R3  1kΩ  [R0805]  50.24 52.34 180 top
R4  1kΩ  [R0805]  50.24 54.46 180 top
R5  3.9kΩ  [R0805]  36.09 70.91 0 top
R6  1kΩ  [R0805]  37.34 67.7 90 top
R7  1kΩ  [R0805]  34.93 67.7 90 top
R8  1kΩ  [R0805]  36.34 45.07 180 top
R9  1kΩ  [R0805]  36.34 43.01 180 top
R10  1kΩ  [R0805]  50.24 43.01 180 top
R11  1kΩ  [R0805]  50.24 45.07 180 top
R12  1kΩ  [R0805]  88.18 16.84 180 top
R13  2.2kΩ  [R0805]  88.18 20.71 180 top
R14  3.3kΩ  [R0805]  88.18 24.57 180 top
R15  3.3kΩ  [R0805]  88.18 31.71 180 top
R16  3.3kΩ  [R0805]  88.18 35.8 180 top
R17  1kΩ  [R0805]  17.08 45.61 0 top
R18  1kΩ  [R0805]  36.34 36.43 180 top
R19  1kΩ  [R0805]  36.34 34.29 180 top
R20  1kΩ  [R0805]  17.08 48.1 0 top
R21  1kΩ  [R0805]  50.27 34.29 180 top
R22  1kΩ  [R0805]  17.08 50.6 0 top
R23  1kΩ  [R0805]  17.08 53.1 0 top
R24  1kΩ  [R0805]  50.24 36.79 180 top
R25  1kΩ  [R0805]  78.67 3.8 180 top
R26  1kΩ  [R0805]  39.05 8.87 90 top
R27  1kΩ  [R0805]  36.51 8.87 90 top
R28  1kΩ  [R0805]  34.09 8.87 90 top
R29  1kΩ  [R0805]  31.49 8.87 90 top
R30  1kΩ  [R0805]  78.67 6.58 180 top
R31  1kΩ  [R0805]  78.67 9.77 0 top
S1  KCD11-2P-R  [SW-TH_2P-L15.0-W10.5-P5.00_KCD11-2P-R]  17.53 61.84 90 top
S2  57eebe39935b4dee9f9f584168dffb74  [SW-TH_DSWB04LHGET]  7.81 49.35 270 top
S3  KCD11-2P-R  [SW-TH_2P-L15.0-W10.5-P5.00_KCD11-2P-R]  89.18 45.23 90 top
U1  TPS73633DBVR  [SOT-23-5_L3.0-W1.7-P0.95-LS2.8-BR]  74.08 30.13 90 top
U2  LM2663M/NOPB  [SOIC-8_L4.9-W3.9-P1.27-LS6.0-BL]  16.14 13.73 270 top
U3  HCPL-0631-500E  [SOIC-8_L4.9-W3.9-P1.27-LS6.0-BL]  43.18 53.1 90 top
U4  TPS73633MDBVREP  [SOT-23-5_L2.9-W1.6-P0.95-LS2.8-BR]  31.11 67.17 0 top
U5  22uF  [CAP-SMD_L7.3-W4.3-RD]  35.25 62.5 180 top
U6  HCPL-0631-500E  [soic-8_l4.9-w3.9-p1.27-ls6.0-bl]  43.18 43.9 90 top
U7  HCPL-0631-500E  [SOIC-8_L4.9-W3.9-P1.27-LS6.0-BL]  43.18 35.68 90 top

## Footprints (pads in the part's own frame, mm; a bottom-side part is the same pattern mirrored in y, then rotated)
BUZ-TH_BD12.0-P7.60-D0.6-FD
  round 1.8 hole 1: 1(-3.8,0) 2(3.8,0)
C0805
  rect 1.41x1.35 smd: 1(-1,0) 2(1,0)
CAP-SMD_L3.2-W1.6-RD-C7171
  rect 1.758x1.296 smd: 1(-1.687,0) 2(1.687,0)
CAP-SMD_L6.0-W3.2-R-RD
  rect 2.208x2.376 smd: 1(2.961,0) 2(-2.961,0)
CAP-SMD_L7.3-W4.3-RD
  rect 2.208x2.592 smd: 1(3.511,0) 2(-3.511,0)
HDR-SMD_1P-P2.54-V-M_XKB_R1
  rect 1.27x2.2 smd: 1(0,0)
HDR-TH_2P-P2.54-V-M
  rect 2x2 hole 1.2: 1(-1.27,0)
  round 2 hole 1.2: 2(1.27,0)
HDR-TH_3P-P2.54-V-M
  rect 1.7x1.7 hole 1.1: 1(-2.54,0)
  round 1.7 hole 1.1: 2(0,0) 3(2.54,0)
HDR-TH_4P-P2.54-V-M
  rect 1.7x1.7 hole 1.1: 1(-3.81,0)
  round 1.7 hole 1.1: 2(-1.27,0) 3(1.27,0) 4(3.81,0)
HDR-TH_5P-P2.00-V-M
  rect 1.524x1.4 hole 0.9: 1(-4,0)
  round 1.4 hole 0.9: 2(-2,0) 3(0,0) 4(2,0) 5(4,0)
HDR-TH_6P-P2.54-V-M
  rect 1.7x1.7 hole 1.1: 1(-6.35,0)
  round 1.7 hole 1.1: 2(-3.81,0) 3(-1.27,0) 4(1.27,0) 5(3.81,0) 6(6.35,0)
HDR-TH_8P-P2.54-V-M
  rect 1.5x1.5 hole 1: 1(-8.89,0)
  round 1.5 hole 1: 2(-6.35,0) 3(-3.81,0) 4(-1.27,0) 5(1.27,0) 6(3.81,0) 7(6.35,0) 8(8.89,0)
HDR-TH_12P-P2.54-V-M
  rect 1.524x1.524 hole 1.05: 1(-13.97,0)
  round 1.524 hole 1.05: 2(-11.43,0) 3(-8.89,0) 4(-6.35,0) 5(-3.81,0) 6(-1.27,0) 7(1.27,0) 8(3.81,0) 9(6.35,0) 10(8.89,0) 11(11.43,0) 12(13.97,0)
HDR-TH_20P-P2.54-V-M-R2-C10-S2.54
  rect 1.7x1.7 hole 1.1: 1(-11.43,-1.27)
  round 1.7 hole 1.1: 2(-11.43,1.27) 3(-8.89,-1.27) 4(-8.89,1.27) 5(-6.35,-1.27) 6(-6.35,1.27) 7(-3.81,-1.27) 8(-3.81,1.27) 9(-1.27,-1.27) 10(-1.27,1.27) 11(1.27,-1.27) 12(1.27,1.27) 13(3.81,-1.27) 14(3.81,1.27) 15(6.35,-1.27) 16(6.35,1.27) 17(8.89,-1.27) 18(8.89,1.27) 19(11.43,-1.27) 20(11.43,1.27)
HDR-TH_22P-P2.54-V-M-R2-C11-S2.54
  rect 1.7x1.7 hole 1.1: 1(-12.7,-1.27)
  round 1.7 hole 1.1: 2(-12.7,1.27) 3(-10.16,-1.27) 4(-10.16,1.27) 5(-7.62,-1.27) 6(-7.62,1.27) 7(-5.08,-1.27) 8(-5.08,1.27) 9(-2.54,-1.27) 10(-2.54,1.27) 11(0,-1.27) 12(0,1.27) 13(2.54,-1.27) 14(2.54,1.27) 15(5.08,-1.27) 16(5.08,1.27) 17(7.62,-1.27) 18(7.62,1.27) 19(10.16,-1.27) 20(10.16,1.27) 21(12.7,-1.27) 22(12.7,1.27)
L0603
  rect 0.8x0.864 smd: 1(-0.7,0) 2(0.7,0)
LED0805-RD_RED
  rect 1x1.25 smd: 1(-1.1,0) 2(1.1,0)
R0805
  rect 1.133x1.377 smd: 1(-1,0) 2(1,0)
SMA_L4.3-W2.5-LS5.0-RD
  rect 2x1.593 smd: 1(-2.1,0) 2(2.1,0)
SMA_L4.4-W2.6-LS5.0-RD
  rect 1.8x1.7 smd: 1(-2.192,0) 2(2.192,0)
soic-8_l4.9-w3.9-p1.27-ls6.0-bl
  oval 0.588x2.045 smd: 1(-1.905,-2.772) 2(-0.635,-2.772) 3(0.635,-2.772) 4(1.905,-2.772) 5(1.905,2.772) 6(0.635,2.772) 7(-0.635,2.772) 8(-1.905,2.772)
SOIC-8_L4.9-W3.9-P1.27-LS6.0-BL
  oval 0.588x2.045 smd: 1(-1.905,-2.772) 2(-0.635,-2.772) 3(0.635,-2.772) 4(1.905,-2.772) 5(1.905,2.772) 6(0.635,2.772) 7(-0.635,2.772) 8(-1.905,2.772)
SOT-23-5_L2.9-W1.6-P0.95-LS2.8-BR
  rect 1x0.6 smd: 1(1.1,-0.95) 2(1.1,0) 3(1.1,0.95) 4(-1.1,0.95) 5(-1.1,-0.95)
SOT-23-5_L3.0-W1.7-P0.95-LS2.8-BR
  rect 1x0.6 smd: 1(1.3,-0.95) 2(1.3,0) 3(1.3,0.95) 4(-1.3,0.95) 5(-1.3,-0.95)
SOT-223-4_L6.5-W3.5-P2.30-LS7.0-BR
  rect 2.47x0.98 smd: 1(2.835,-2.3) 2(2.835,0) 3(2.835,2.3)
  rect 2.47x3.6 smd: 4(-2.835,0)
SW-TH_2P-L15.0-W10.5-P5.00_KCD11-2P-R
  oval 1.6x5 hole 0.8x4: 1(-2.5,0) 2(2.5,0)
SW-TH_DSWB04LHGET
  round 1.8 hole 1.2: 1(-3.81,3.81) 2(-1.27,3.81) 3(1.27,3.81) 4(3.81,3.81) 5(-3.81,-3.81) 6(-1.27,-3.81) 7(1.27,-3.81) 8(3.81,-3.81)
TO-92-3_L4.6-W3.6-P1.30-L_2N3904
  rect 1x1 hole 0.65: 1(-1.3,0)
  round 1 hole 0.65: 2(0,0) 3(1.3,0)
固定孔封装
  round 0.584 hole 0.559: 1(-2.032,0) 1(-1.778,1.016) 1(-1.778,-1.016) 1(-1.016,1.778) 1(-1.016,-1.778) 1(0,-2.032) 1(1.016,1.778) 1(1.016,-1.778) 1(1.778,1.016) 1(1.778,-1.016) 1(2.032,0)
  round 0.584 hole 3.048x0.559: 1(0,2.032)
  round 5.08 hole 3.048: 1(0,0)

## Nets
As in the schematic.

Pads without a net: J10 7 8 9 10 16 18; J11 6 7 8 10 13 14 15 17 18 19 20; J12 11 12 13 14 15 16; R24 1; U1 4

## Via types
v1: diameter 0.61, hole 0.305, Top Layer to Bottom Layer, 76 vias

## Routing (per net, layer and track width the routed paths; a pad name or vN(x,y) marks a point on that pad's centre or on a via; arc(x,y) is an arc through that point)
GND: length 296.7
  Top Layer w0.254: 20.32,10.97 20.29,10.94 15.24,10.94 15.24,13.1 ; 20.32,10.97 20.32,9.92 19.43,9.03 19.43,1.92 26.41,1.92 J14.6 26.41,6.85 C4.1 24.27,21.6 C6.1 ; 20.32,10.97 20.32,13.1 U2.6 ; 84.04,11.06 80.77,11.06 80.77,8.4 77.24,8.4 J3.3 ; 84.04,11.06 84.04,13.82 83.75,14.11 ; 84.04,11.06 C17.1 ; 15.24,13.1 U2.3 ; 15.24,13.1 15.24,15.64 U2.1 13.37,20.59 14.92,20.59 14.99,20.52 ; J11.22 61.66,30.75 L2.2 ; J11.21 53.59,30.75 52.58,29.73 52.58,26.82 J10.17 49.78,26.81 48.01,26.81 47.24,27.57 47.24,29.22 v1(34.67,29.22) ; U1.2 74.04,31.39 74.04,30.11 72.64,30.11 71.63,29.1 71.63,27.07 72.24,26.45 C1.1 ; J12.2 29.59,56.15 31.37,57.93 38.76,57.93 U5.2 ; C15.1 58.93,65.95 58.93,72.79 67.12,72.79 J4.3 ; J5.6 1.52,37.35 1.52,22.49 14.99,22.49 14.99,20.52 ; 14.99,20.52 C5.1 ; C2.1 73.38,24.14 v1(71.5,24.14)
  Bottom Layer w0.254: v1(34.67,29.22) 34.67,26.69 J10.3 ; J10.1 16.89,25.41 v1(16.89,22.87) ; J17.2 86.23,11.63 81.97,15.89 78.23,15.89 78.23,21.86 71.5,21.86 v1(71.5,24.14) 54.98,24.14 J10.19 ; J12.2 27.81,57.8 23.24,57.8 23.24,56.15 4.06,56.15 4,56.08 S2.5
  vias: v1(16.13,22.87) v1(16.13,22.11) v1(16.9,22.11) v1(55.37,66.82) v1(56.01,66.82) v1(56.67,66.82) v1(57.32,66.82)
V5: length 98.2
  Top Layer w0.254: C13.1 68.66,61.48 67.06,61.48 63.75,58.18 v1(51.05,58.18) ; R2.2 37.12,50.56 40.41,50.56 U3.8 ; R16.2 v1(85.72,35.8) ; U7.8 40.41,32.91 35.69,32.91 35.34,33.26 R19.2 ; v1(51.05,56.91) 33.78,56.91 33.4,56.53 33.4,50.69 v1(34.8,50.69) v1(35.61,50.69) ; U6.8 40.41,41.06 40.39,41.04 37.31,41.04 R9.2
  Bottom Layer w0.254: v1(73.58,53.76) 73.61,53.74 85.72,53.74 v1(85.72,35.8) ; v1(51.05,58.18) v1(51.05,56.91)
  vias: v1(72.9,54.5) v1(72.89,53.76) v1(73.58,54.5)
V6: length 134.1
  Top Layer w0.254: v1(52.48,66.44) 52.48,75.33 74.04,75.33 79.5,69.86 99.06,69.86 99.06,45.99 ; 87.12,31.65 v1(85.67,31.65) ; 87.12,31.65 87.12,29.61 87.38,29.35 99.06,29.35 99.06,45.99 ; 87.12,31.65 R15.2 ; U4.5 28.57,66.22 28.57,72.53 37.08,72.53 37.08,70.92 R5.2 ; 99.06,45.99 J15.2
  vias: v1(51.05,66.44) v1(51.75,66.44)
VBAT: length 83
  Top Layer w0.254: S1.1 21.61,59.34 D3.2 v1(26.96,66.56)
  Bottom Layer w0.254: v1(83.95,68.85) 83.95,74.06 27.31,74.06 26.96,73.71 v1(26.96,66.56)
  vias: v1(84.74,68.85) v1(85.48,68.85) v1(86.18,68.85)
VBAT+: length 14.8
  Top Layer w0.254: J2.1 16.85,63.67 S1.2
VCC3.3: length 227.2
  Top Layer w0.254: v1(19.81,45.61) R17.2 18.08,42.22 10.67,34.81 J5.5 ; 67.69,2.43 77.6,2.43 77.67,2.5 R25.2 ; 67.69,2.43 67.82,2.55 J3.1 ; 67.69,2.43 55.63,2.43 J9.1 ; R20.2 v1(19.81,48.1) ; 76.55,28.83 76.85,28.83 76.96,28.72 76.96,24.4 76.84,24.27 75.63,24.27 C2.2 ; 76.55,28.83 v1(76.55,29.73) ; 76.55,28.83 U1.5 ; R23.2 v1(19.81,53.1) ; R22.2 v1(19.81,50.6) ; R12.2 v1(87.18,15.13)
  Bottom Layer w0.254: J12.1 24.13,56.15 23.11,55.13 19.81,55.13 v1(19.81,53.1) ; v1(77.22,5.22) 77.22,0.65 88.52,0.65 88.52,13.79 v1(87.18,15.13) 85.53,16.78 78.61,16.78 78.61,29.73 v1(76.55,29.73) ; 49.08,1.79 55.63,1.79 J9.1 ; 49.08,1.79 J16.4 ; 49.08,1.79 12.19,1.79 12.19,26.56 19.81,26.56 v1(19.81,45.61)
  vias: v1(77.94,5.22)
VCC5: length 210.2
  Top Layer w0.254: R27.2 v1(36.51,11.7) ; U2.8 22.27,15.64 C4.2 22.27,5.33 J14.8 ; D1.2 77.52,22.98 77.55,22.94 ; v1(45.95,32.4) U7.1 43.81,33.78 43.69,33.9 43.69,37.61 45.93,37.61 U7.4 ; v1(50.04,30.37) 52.32,30.37 54.1,32.15 57.4,32.15 v1(57.91,32.65) ; U3.1 43.81,51.2 43.69,51.32 43.69,55.03 45.93,55.03 U3.4 v1(45.95,56.25) ; 77.55,22.94 77.55,22.62 64.01,22.62 ; 77.55,22.94 D9.1 84.95,22.94 R13.2 85.34,18.87 85.34,9.03 84.71,8.4 82.04,8.4 82.04,9.89 ; 64.01,22.62 64.01,19.67 LS1.1 ; 64.01,22.62 J7.1 ; U6.4 45.93,45.82 43.69,45.82 43.69,42.12 43.81,41.99 U6.1 ; R29.2 v1(31.49,11.7) ; R28.2 v1(34.09,11.7) ; R26.2 v1(39.05,11.7)
  Bottom Layer w0.254: J14.7 23.87,11.7 v1(31.49,11.7) ; v1(57.91,32.65) 57.91,32.15 62.63,32.15 J7.3 ; v1(50.04,30.37) 45.97,30.37 45.95,30.39 v1(45.95,32.4) 42.54,32.4 42.29,32.15 42.29,18.94 39.05,15.7 v1(39.05,11.7) ; J4.4 64.55,69.48 45.95,69.48 v1(45.95,56.25)
VCC-5: length 133.1
  Top Layer w0.254: U2.5 17.02,11.83 17.02,18.18 17.14,18.3 18.47,18.3 C6.2 ; 64.01,48.76 62.46,48.76 60.96,47.26 53.72,47.26 53.72,44.34 53.34,43.96 53.34,41.16 52.83,40.65 v1(52.83,39.51) ; v1(87.25,28.08) 87.25,24.64 R14.2 ; v1(26.42,28.34) 22.48,24.4 v1(22.48,24.27)
  Bottom Layer w0.254: v1(52.83,39.51) 41.66,39.51 41.66,30.88 41.53,30.75 31.12,30.75 28.7,28.34 v1(26.42,28.34) ; v1(16.76,18.25) 22.43,18.25 22.48,18.3 v1(22.48,24.27) ; 64.01,48.76 62.48,48.76 62.23,48.5 62.23,39.89 83.82,39.89 84.07,39.64 84.07,28.08 v1(87.25,28.08)
  vias: v1(16.76,18.94) v1(16.76,17.57)
ADB2: length 120.7
  Top Layer w0.254: v1(27.69,10.17) v1(27.69,13.98) ; v1(70.1,23.38) 70.1,48.76 67.99,48.76 ; v1(27.94,0.78) v1(27.94,2.43)
  Bottom Layer w0.254: v1(27.94,0.78) 65.66,0.78 65.53,0.9 65.53,5.47 70.1,10.05 v1(70.1,23.38) ; v1(27.94,2.43) 27.69,2.68 v1(27.69,10.17) ; v1(27.69,13.98) 32.51,13.98 35.81,17.29 35.81,25.3 J10.5
ADE20: length 43.5
  Bottom Layer w0.254: J11.3 54.99,53.61 54.99,26.05 55.25,25.8 65.35,25.8 J6.1
ADE21: length 25.5
  Top Layer w0.254: v1(61.47,53.1) v1(61.47,51.58)
  Bottom Layer w0.254: v1(61.47,53.1) 61.47,53.61 J11.4 ; v1(61.47,51.58) 61.47,37.35 66.31,37.35 67.61,36.06 J6.4
ADE22: length 24.3
  Top Layer w0.254: v1(66.04,53.48) v1(66.04,51.83)
  Bottom Layer w0.254: 67.61,41.14 66.04,42.71 v1(66.04,51.83) ; v1(66.04,53.48) 66.04,55.02 57.86,55.02 J11.1
ADE23: length 25
  Bottom Layer w0.254: J6.8 70.23,46.22 70.23,57.29 69.98,57.55 62.61,57.55 61.21,56.15 J11.2
ADE30: length 12.1
  Bottom Layer w0.254: 67.61,53.84 67.61,53.74 67.31,53.74 66.17,52.59 62.23,52.59 61.98,52.34 58,52.34 J11.5
B16: length 34.3
  Top Layer w0.254: R29.1 J14.4
  Bottom Layer w0.254: J14.4 35.36,8.27 43.55,8.27 J10.11
B17: length 33.8
  Top Layer w0.254: R27.1 36.51,4.46 J14.2
  Bottom Layer w0.254: J14.2 40.06,7.89 44.83,7.89 44.83,26.68 J10.12
C0: length 39.7
  Top Layer w0.254: J3.2 70.36,6.75 54.36,6.75 54.36,19.69 J10.15
C3: length 44.8
  Top Layer w0.254: J10.20 54.86,26.8 54.86,7.38 75.28,7.38 R31.1
C4: length 29.8
  Top Layer w0.254: J14.3 34.09,4.46 R28.1 32.77,7.87 32.77,15.51 27.81,20.46 J12.22
C5: length 36.7
  Top Layer w0.254: J12.21 26.16,30.75 27.43,32.02 28.57,32.02 29.08,31.51 29.08,20.59 37.85,11.83 37.85,7.76 38.94,7.76 R26.1 39.11,7.81 J14.1
C6: length 27.5
  Top Layer w0.254: J12.20 27.81,33.16 26.67,32.02 24.77,32.02 17.4,24.65 4,24.65
C7: length 23.8
  Top Layer w0.254: J5.2 19.18,27.19 J12.19
C8: length 26.3
  Top Layer w0.254: J12.18 26.54,34.56 24.77,34.56 19.94,29.73 J5.3
C9: length 22.7
  Top Layer w0.254: J12.17 21.72,32.27 J5.4
CCDB0: length 29.2
  Top Layer w0.254: J16.1 43.08,12.18 32,23.26 32,27.45 31.5,27.95 J10.2
CCDB1: length 28.6
  Top Layer w0.254: J16.2 45.08,10.68 34.67,21.1 34.67,26.68 J10.4
CCDB3: length 28.4
  Top Layer w0.254: J10.6 37.21,26.68 37.21,19.06 47.08,9.19 J16.3
D4: length 21
  Top Layer w0.254: S2.1 11.68,53.1 R23.1 16.13,53.15 16.13,54.88 26.54,54.88 26.54,52.34 J12.6
D5: length 15.2
  Top Layer w0.254: S2.2 16.06,50.62 R22.1 16.08,51.78 16.13,51.83 24.51,51.83 J12.5
D6: length 35.5
  Top Layer w0.254: J12.4 27.81,54.37 26.54,55.64 26.54,57.67 10.29,57.67 10.29,49.42 S2.3 16.06,48.08 R20.1
D7: length 22.6
  Top Layer w0.254: J12.3 25.27,52.85 26.54,51.58 26.54,47.13 19.94,47.13 19.69,46.88 17.35,46.88 R17.1 16.01,45.54 S2.4
GGND: length 120.7
  Top Layer w0.254: C7.2 77.72,65.96 76.49,67.19 71.98,67.19 J4.2 ; U6.5 40.48,45.73 42.54,45.73 ; 42.54,45.73 42.54,55.01 U3.5 v1(40.41,56.15) ; 42.54,45.73 42.54,37.61 40.43,37.61 U7.5 ; J1.1 v1(5.21,59.53)
  Bottom Layer w0.254: v1(5.21,59.53) 10.08,59.53 11.81,57.8 22.1,57.8 22.35,58.05 22.35,58.82 22.22,58.94 40.41,58.94 v1(40.41,56.15) 40.39,56.13 40.39,55.51 46.74,55.51 46.74,67.45 69.6,67.45 69.66,67.51 J4.2
GHGL: length 81.7
  Top Layer w0.254: J10.13 53.21,18.29 53.21,1.67 53.47,1.41 89.92,1.41 89.92,7.89 88.77,9.03 86.02,9.03 J17.1 83.57,6.58 R30.1
GHGR: length 63.9
  Top Layer w0.254: J10.14 46.1,27.95 47.24,26.81 47.24,25.16 53.72,18.68 53.72,2.05 82.09,2.05 J13.1 83.65,3.8 R25.1
LPWM1: length 88.6
  Top Layer w0.254: R9.1 v1(38.7,43.01) 40.15,43.01 U6.7 ; J8.1 96.61,67.2 92.46,67.2 v1(92.46,57.67)
  Bottom Layer w0.254: v1(38.7,43.01) 50.42,43.01 50.42,41.54 54.48,41.54 54.48,57.93 92.2,57.93 v1(92.46,57.67)
LPWM2: length 83.7
  Top Layer w0.254: J8.3 96.49,61.99 93.22,61.99 v1(93.22,58.43) ; R8.1 38.51,45.07 v1(38.79,44.79) 39.05,44.53 U6.6
  Bottom Layer w0.254: v1(38.79,44.79) 51,44.79 51.05,44.85 51.05,42.18 53.85,42.18 53.85,58.43 v1(93.22,58.43)
MOTORL+: length 29
  Top Layer w0.254: 51.31,43.01 51.37,43.07 v1(52.58,43.07)
  Bottom Layer w0.254: J12.10 52.07,45.99 52.07,43.07 v1(52.58,43.07)
MOTORL-: length 32.3
  Top Layer w0.254: 51.31,45.07 v1(52.78,45.07)
  Bottom Layer w0.254: v1(52.78,45.07) 52.83,45.12 52.83,47.13 25.27,47.13 J12.9
MOTORR+: length 42.6
  Top Layer w0.254: J12.8 29.84,48.53 29.84,55.77 31.62,57.55 54.23,57.55 54.23,52.34 R3.1
MOTORR-: length 34.8
  Top Layer w0.254: R4.1 v1(52.71,54.46)
  Bottom Layer w0.254: v1(52.71,54.46) 52.71,49.67 25.27,49.67 J12.7
PWM5: length 9.7
  Top Layer w0.254: J11.16 57.87,36.97 55.63,36.97 52.94,34.29 R21.1
RPWM1: length 76.3
  Top Layer w0.254: R2.1 v1(38.73,52.34) 40.28,52.34 U3.7
  Bottom Layer w0.254: J8.2 97.92,63.42 97.92,58.31 95.63,58.31 94.87,59.07 48.13,59.07 48.13,52.34 v1(38.73,52.34)
RPWM2: length 66.6
  Top Layer w0.254: R1.1 38.53,54.46 v1(38.81,54.19) 39.26,53.74 U3.6
  Bottom Layer w0.254: v1(38.81,54.19) 47.62,54.19 47.62,59.58 96.61,59.58 J8.4
RX: length 44.7
  Top Layer w0.254: v1(54.36,37.48) 54.36,41.08 J11.11
  Bottom Layer w0.254: v1(54.36,37.48) 54.36,30.88 52.3,28.82 52.3,12.46 J9.3
SERVODUTY: length 79.1
  Top Layer w0.254: v1(83.19,34.81) 83.19,38.62 v1(94.11,38.62) ; R19.1 38.5,34.29 39.26,35.05 U7.7 42.65,35.05 42.67,35.07 42.67,31.26 52.32,31.26 55.5,34.43 60.2,34.43 v1(60.58,34.05)
  Bottom Layer w0.254: 96.75,48.53 94.11,48.53 v1(94.11,38.62) ; v1(60.58,34.05) 62.87,34.05 63.63,34.81 v1(83.19,34.81)
TX: length 48.2
  Top Layer w0.254: J11.9 53.72,42.98 v1(53.72,36.21)
  Bottom Layer w0.254: J9.2 49.91,12.31 49.91,28.84 53.72,32.65 v1(53.72,36.21)
$1N186: length 8.7
  Top Layer w0.254: C3.1 6.73,13.89 6.73,11.95 6.86,11.83 U2.4
$1N262: length 10.3
  Top Layer w0.254: C3.2 8.38,19.86 8.38,17.41 11.43,14.37 U2.2
$1N1005: length 7
  Top Layer w0.254: U1.1 75.08,31.38 75.08,30.39 74.04,29.35 74.04,27.7 75.56,27.7 ; C1.2 75.57,27.7
$1N3929: length 4.1
  Top Layer w0.254: U4.3 32.18,68.09 31.12,68.09 31.12,66.18 32.18,66.18 U4.1
$1N6419: length 11.6
  Top Layer w0.254: L1.2 70.29,65.93 69.34,65.93 68.33,66.94 68.33,70.37 68.83,70.88 70.83,70.88 J4.1
$1N6913: length 3.3
  Top Layer w0.254: U3.2 46.08,52.34 R3.2
$1N6963: length 3.6
  Top Layer w0.254: R4.2 48.51,53.74 U3.3
$1N7242: length 3.4
  Top Layer w0.254: U6.2 48.98,43.26 R10.2
$1N7247: length 3.5
  Top Layer w0.254: R11.2 48.71,44.53 U6.3
$1N7507: length 3.1
  Top Layer w0.254: R18.1 37.45,36.32 40.41,36.32
$1N7520: length 3.6
  Top Layer w0.254: R21.2 48.51,35.05 U7.2
$1N7525: length 3.5
  Top Layer w0.254: 45.95,36.32 48.76,36.32 R24.2
$1N11111: length 13.3
  Top Layer w0.254: Q1.2 82.45,18.56 D9.2 80.37,16.84 LS1.2
$1N11153: length 5
  Top Layer w0.254: Q1.1 81.15,12.46 79.67,10.97 R31.2
$1N11725: length 5.4
  Top Layer w0.254: D4.2 94.46,16.84 R12.1
$1N11731: length 5.4
  Top Layer w0.254: 94.55,20.71 94.55,20.71 R13.1
$1N11737: length 5.4
  Top Layer w0.254: R14.1 94.47,24.57 D6.2
$1N11743: length 5.4
  Top Layer w0.254: R15.1 94.47,31.71 D7.2
$1N11746: length 5.4
  Top Layer w0.254: D8.2 94.47,35.8 R16.1

## Copper pours and planes (outline as drawn; the poured copper is in the pictures)
AGND on Top Layer: 58,44.71 61.72,44.71 61.85,44.84 61.85,47.51 65.91,47.51 65.91,37.1 62.61,37.1 62.36,37.35 62.36,34.26 60.9,34.26 60.9,42.05 58,42.05
GND on Top Layer: 59.69,67.32 59.82,67.2 59.82,64.18 58.09,64.18 58.09,58.69 54.87,58.69 54.87,67.35 54.9,67.32
GND on Top Layer: 55.46,31.63 60.54,31.63 60.54,29.25 55.46,29.25
GND on Top Layer: 72.65,27.31 74.57,27.31 74.57,23.4 72.65,23.4
GND on Top Layer: 17.78,14.87 20.57,14.87 20.57,12.59 17.78,12.59
GND on Top Layer: 55,63.49 58.02,63.49 58.04,63.51 58.04,59.96 58.17,59.83 55.12,59.83 54.99,59.7 54.99,58.69 43.31,58.69 43.31,64.78 43.43,64.91 46.23,64.91 46.48,64.66 46.48,60.47 46.35,60.34 55.04,60.34 55.04,63.46
GND on Top Layer: 2.54,54.62 5.46,54.62 5.46,36.21 2.54,36.21
GND on Top Layer: 0,77.9 100,77.9 100,0 0,0
GND on Top Layer: 96.15,25.44 97.75,25.44 97.75,15.99 96.15,15.99
GND on Top Layer: 50.16,26.81 54.61,26.81 54.61,24.27 50.16,24.27
GND on Top Layer: 14.16,19.85 19.41,19.85 19.43,19.83 19.43,23.39 14.16,23.39 14.16,23.25
GND on Top Layer: 85.19,7.97 88.32,7.97 88.32,2.43 85.19,2.43
GND on Top Layer: 31.5,67.58 41.21,67.58 41.21,65.42 47.37,65.42 47.5,65.29 47.5,60.23 37.02,60.23 37.02,64.72 33.84,64.72 33.53,65.04 33.53,66.7 31.5,66.7
GND on Top Layer: 25.25,5.67 30.03,5.67 30.03,3.13 25.25,3.13
GND on Bottom Layer: 0,77.9 100,77.9 100,0 0,0
GND on Bottom Layer: 29.58,26.68 34.61,26.68 34.61,23.64 29.58,23.64
V5 on Top Layer: 34.16,55.51 36.34,55.51 36.34,32.9 34.16,32.9
V5 on Top Layer: 70.09,63.14 70.87,58.18 74.6,57.49 74.91,57.17 74.91,55.24 74.55,54.88 74.55,49.16 74.29,48.91 72.39,48.91 72.26,49.04 72.26,56.67 69.47,56.91 68.88,58.67 67.18,58.67 67.18,65.55 69.58,65.55 69.58,63.65
V5 on Top Layer: 71.54,66.44 73.53,66.44 73.53,62.64 68.84,62.64 68.83,62.62 68.83,63.77 68.96,63.9 71.54,63.9
V6 on Top Layer: 36.59,71.87 38.48,71.87 38.48,68.09 36.59,68.09
V6 on Top Layer: 50.56,60.97 53.09,60.97 53.21,60.85 53.21,69.59 36.47,69.59 36.32,69.74 36.32,68.21 36.45,68.09 50.55,68.09 50.67,67.96 50.56,67.85
VBAT on Top Layer: 83.44,69.39 89.48,69.39 89.48,63.48 83.44,63.48
VCC3.3 on Top Layer: 76.9,7.49 78.67,7.49 78.67,2.88 76.9,2.88
VCC3.3 on Bottom Layer: 18.84,54.02 21.21,54.02 21.21,44.72 18.84,44.72
VCC5 on Top Layer: 44.7,42.61 47.62,42.61 47.62,36.97 44.7,36.97
VCC5 on Top Layer: 65.73,70.78 65.73,67.65 65.66,67.58 62.36,67.58 62.36,65.17 62.1,64.91 62.61,64.4 64.77,64.4 64.77,60.09 64.64,59.96 61.09,59.96 60.72,60.34 60.72,64.29 60.83,64.4 60.2,64.4 60.07,64.53 60.07,70.78
VCC5 on Top Layer: 44.7,51.78 47.62,51.78 47.62,45.1 44.7,45.1
VCC5 on Top Layer: 62.74,36.85 65.28,36.85 65.28,27.17 62.74,27.17
VCC5 on Top Layer: 20.06,5.67 24.77,5.67 24.77,3.13 20.06,3.13
VCC5 on Bottom Layer: 30.48,12.97 39.97,12.97 39.97,10.63 30.48,10.63
VCC-5 on Top Layer: 14.15,19.45 19.43,19.45 19.43,17.03 14.15,17.03
VCC-5 on Top Layer: 62.74,57.65 65.28,57.65 65.28,47.87 62.74,47.87
ADB2 on Top Layer: 66.85,52.31 69.39,52.31 69.39,47.69 66.85,47.69
ADE20 on Top Layer: 66.72,32.22 69.26,32.22 69.26,27.3 66.72,27.3
ADE21 on Top Layer: 66.72,37.16 69.26,37.16 69.26,32.56 66.72,32.56
ADE22 on Top Layer: 66.72,42.15 69.26,42.15 69.26,37.5 66.72,37.5
ADE23 on Top Layer: 66.72,47.26 69.26,47.26 69.26,42.68 66.72,42.68
ADE30 on Top Layer: 66.85,57.65 69.17,57.65 69.17,52.66 66.85,52.66
GGND on Top Layer: 73.53,46.75 81.81,46.75 81.81,44.06 82.04,43.83 91.69,43.83 91.82,43.7 91.82,41.54 91.95,41.42 73.91,41.42 73.53,41.8
GGND on Top Layer: 75.18,57.55 76.9,57.55 76.9,44.04 75.18,44.04
GGND on Top Layer: 86.18,43.83 94.99,43.83 94.99,44.68 97.95,44.68 98.17,44.46 98.17,34.77 96.15,34.77 96.15,41.42 86.11,41.42 86.18,41.5
GGND on Top Layer: 96.15,36.67 97.75,36.67 97.75,30.66 96.15,30.66
GGND on Top Layer: 80.52,67.32 73.79,67.32 73.79,59.2 74.04,58.94 75.22,58.94 75.22,55.21 76.76,55.21 76.84,55.13 76.84,58.69 77.09,58.94 80.52,58.94 80.52,67.32
$1N1005 on Top Layer: 72.22,35.7 74.13,35.7 74.13,32.86 75.1,32.86 75.69,32.27 75.69,30.88 75.44,30.62 74.68,30.62 74.55,30.75 74.55,32.34 73.59,32.34 73.59,30.76 72.76,30.76 72.64,30.88 72.64,32.82 72.31,32.82 72.26,32.78 72.22,32.82
$1N3929 on Top Layer: 33.04,64.17 33.04,59.36 28.36,59.36 28.32,59.32 25.53,59.32 25.53,61.46 30.07,61.46 30.35,61.74 30.35,64.15 33.02,64.15
$1N3929 on Top Layer: 31.12,66.58 33.02,66.58 33.02,60.85 32.89,60.72 30.42,60.72 30.42,65.17 31.16,65.17 31.16,66.54
$1N4120 on Top Layer: 35.85,68.18 35.85,71.87 34.06,71.87 34.04,71.9 34.04,69.46 30.71,69.46 30.61,69.36 29.32,69.36 29.34,68.72 29.34,67.71 30.7,67.71 30.7,68.56 30.73,68.59 33.93,68.59 33.93,68.18
$1N5968 on Top Layer: 90.12,62.86 82.32,62.86 82.32,57.67 77.47,57.67 77.34,57.55 77.34,48.66 77.47,48.53 77.53,48.59 79.48,48.59 79.63,48.74 79.63,56.02 89.66,56.02 90.17,56.53 90.17,62.82
$1N12522 on Top Layer: 97.95,58.29 97.95,53.2 98.04,53.1 92.46,53.1 92.2,52.85 92.2,46.37 92.07,46.24 85.98,46.24 85.85,46.37 85.85,55.39 85.98,55.51 93.98,55.51 94.23,55.26 94.23,58.34 94.29,58.29
